# EAGLE design node (EAGLE 9.6.2)

## Sheet 1 of 5: MCU
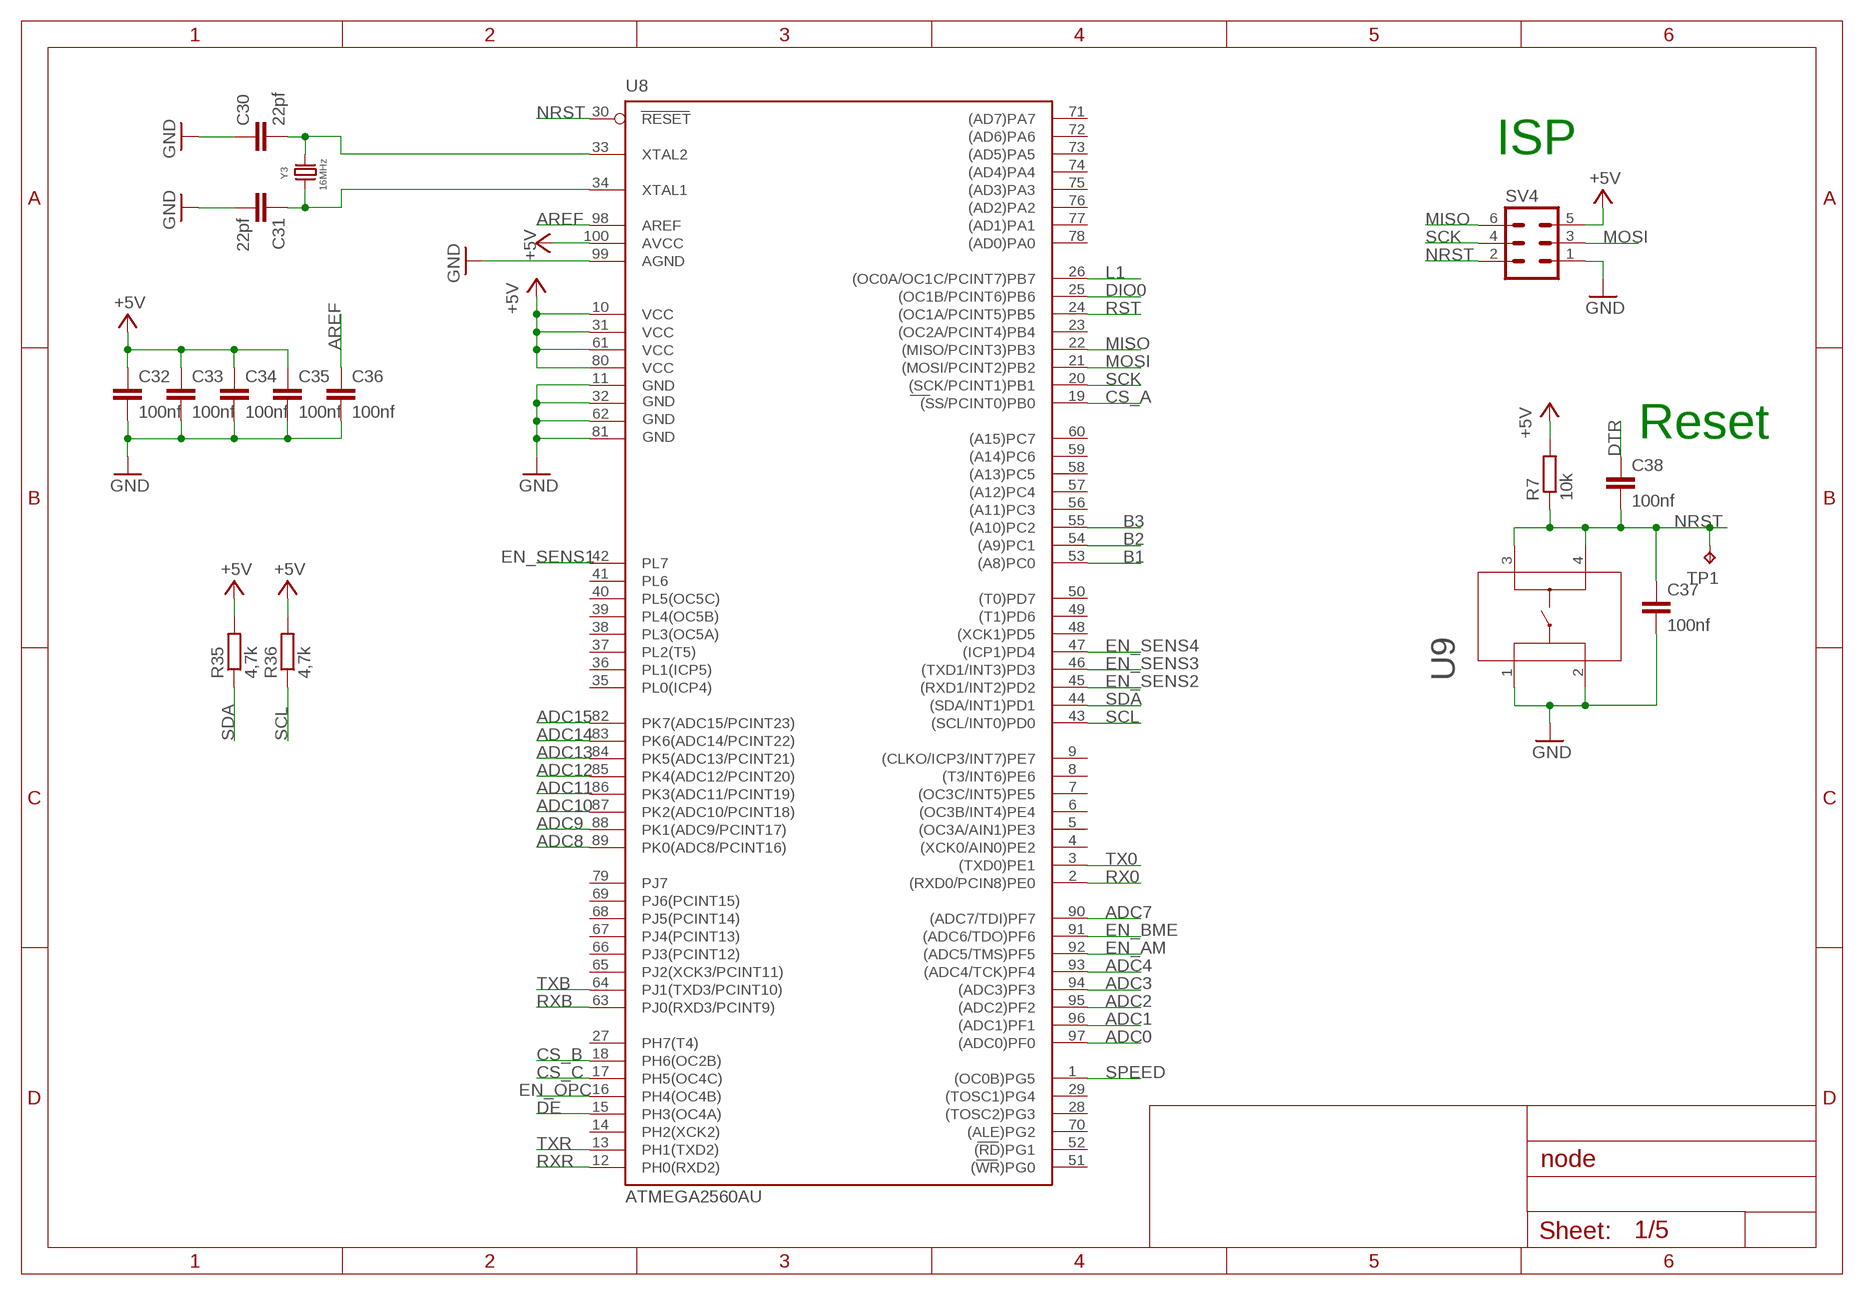
[diagram p0: schematic, sheet 1]

### Parts
C30  22pf  C-EUC0603  [C0603]
C31  22pf  C-EUC0603  [C0603]
C32  100nf  C-EUC0805  [C0805]
C33  100nf  C-EUC0805  [C0805]
C34  100nf  C-EUC0805  [C0805]
C35  100nf  C-EUC0805  [C0805]
C36  100nf  C-EUC0805  [C0805]
C37  100nf  C-EUC0805  [C0805]
C38  100nf  C-EUC0805  [C0805]
R7  10k  R-EU_R0805  [R0805]
R35  4,7k  R-EU_R0603  [R0603]
R36  4,7k  R-EU_R0603  [R0603]
SV4  MA03-2  [MA03-2]
TP1  TPTP13R  [TP13R]
U8  ATMEGA2560AU  [TQFP100]
U9  1-1825910-0  [SWITCH_1-1825910-0]
Y3  16MHz  WE-XTAL_HC49/4H_830003240B  [WE-XTAL_HC49/4H]

### Nets
+5V: C32.1 C33.1 C34.1 C35.1 R7.2 R35.2 R36.2 SV4.5 U8.10(VCC) U8.31(VCC1) U8.61(VCC2) U8.80(VCC3) U8.100(AVCC) ; also sheet 2,3,4,5
ADC0: U8.97((ADC0)PF0)
ADC1: U8.96((ADC1)PF1) ; also sheet 5
ADC2: U8.95((ADC2)PF2) ; also sheet 5
ADC3: U8.94((ADC3)PF3) ; also sheet 5
ADC4: U8.93((ADC4/TCK)PF4) ; also sheet 5
ADC7: U8.90((ADC7/TDI)PF7) ; also sheet 3
ADC8: U8.89(PK0(ADC8/PCINT16))
ADC9: U8.88(PK1(ADC9/PCINT17))
ADC10: U8.87(PK2(ADC10/PCINT18))
ADC11: U8.86(PK3(ADC11/PCINT19))
ADC12: U8.85(PK4(ADC12/PCINT20))
ADC13: U8.84(PK5(ADC13/PCINT21))
ADC14: U8.83(PK6(ADC14/PCINT22))
ADC15: U8.82(PK7(ADC15/PCINT23))
AREF: C36.1 U8.98(AREF)
B1: U8.53((A8)PC0) ; also sheet 5
B2: U8.54((A9)PC1) ; also sheet 5
B3: U8.55((A10)PC2)
CS_A: U8.19((SS/PCINT0)PB0) ; also sheet 2
CS_B: U8.18(PH6(OC2B)) ; also sheet 3
CS_C: U8.17(PH5(OC4C)) ; also sheet 3
DE: U8.15(PH3(OC4A)) ; also sheet 2
DIO0: U8.25((OC1B/PCINT6)PB6) ; also sheet 2
DTR: C38.1 ; also sheet 2
EN_AM: U8.92((ADC5/TMS)PF5) ; also sheet 3
EN_BME: U8.91((ADC6/TDO)PF6) ; also sheet 3
EN_OPC: U8.16(PH4(OC4B)) ; also sheet 3
EN_SENS1: U8.42(PL7) ; also sheet 3
EN_SENS2: U8.45((RXD1/INT2)PD2) ; also sheet 3
EN_SENS3: U8.46((TXD1/INT3)PD3) ; also sheet 3
EN_SENS4: U8.47((ICP1)PD4) ; also sheet 3
GND: C30.1 C31.2 C32.2 C33.2 C34.2 C35.2 C36.2 C37.2 SV4.1 U8.11(GND) U8.32(GND1) U8.62(GND2) U8.81(GND3) U8.99(AGND) U9.1 U9.2 ; also sheet 2,3,4,5
L1: U8.26((OC0A/OC1C/PCINT7)PB7) ; also sheet 2
MISO: SV4.6 U8.22((MISO/PCINT3)PB3) ; also sheet 2,3
MOSI: SV4.3 U8.21((MOSI/PCINT2)PB2) ; also sheet 2,3
N$23: C30.2 U8.33(XTAL2) Y3.2
N$27: C31.1 U8.34(XTAL1) Y3.1
NRST: C37.1 C38.2 R7.1 SV4.2 TP1.TP U8.30(RESET) U9.3 U9.4
RST: U8.24((OC1A/PCINT5)PB5) ; also sheet 2
RX0: U8.2((RXD0/PCIN8)PE0) ; also sheet 2
RXB: U8.63(PJ0(RXD3/PCINT9)) ; also sheet 2
RXR: U8.12(PH0(RXD2)) ; also sheet 2
SCK: SV4.4 U8.20((SCK/PCINT1)PB1) ; also sheet 2,3
SCL: R36.1 U8.43((SCL/INT0)PD0) ; also sheet 2,3,4,5
SDA: R35.1 U8.44((SDA/INT1)PD1) ; also sheet 2,3,4,5
SPEED: U8.1((OC0B)PG5) ; also sheet 3
TX0: U8.3((TXD0)PE1) ; also sheet 2
TXB: U8.64(PJ1(TXD3/PCINT10)) ; also sheet 2
TXR: U8.13(PH1(TXD2)) ; also sheet 2
Unconnected: U8.4((XCK0/AIN0)PE2) U8.5((OC3A/AIN1)PE3) U8.6((OC3B/INT4)PE4) U8.7((OC3C/INT5)PE5) U8.8((T3/INT6)PE6) U8.9((CLKO/ICP3/INT7)PE7) U8.14(PH2(XCK2)) U8.23((OC2A/PCINT4)PB4) U8.27(PH7(T4)) U8.28((TOSC2)PG3) U8.29((TOSC1)PG4) U8.35(PL0(ICP4)) U8.36(PL1(ICP5)) U8.37(PL2(T5)) U8.38(PL3(OC5A)) U8.39(PL4(OC5B)) U8.40(PL5(OC5C)) U8.41(PL6) U8.48((XCK1)PD5) U8.49((T1)PD6) U8.50((T0)PD7) U8.51((WR)PG0) U8.52((RD)PG1) U8.56((A11)PC3) U8.57((A12)PC4) U8.58((A13)PC5) U8.59((A14)PC6) U8.60((A15)PC7) U8.65(PJ2(XCK3/PCINT11)) U8.66(PJ3(PCINT12)) U8.67(PJ4(PCINT13)) U8.68(PJ5(PCINT14)) U8.69(PJ6(PCINT15)) U8.70((ALE)PG2) U8.71((AD7)PA7) U8.72((AD6)PA6) U8.73((AD5)PA5) U8.74((AD4)PA4) U8.75((AD3)PA3) U8.76((AD2)PA2) U8.77((AD1)PA1) U8.78((AD0)PA0) U8.79(PJ7)

### Notes on the sheet
- ISP
- Reset

## Sheet 2 of 5
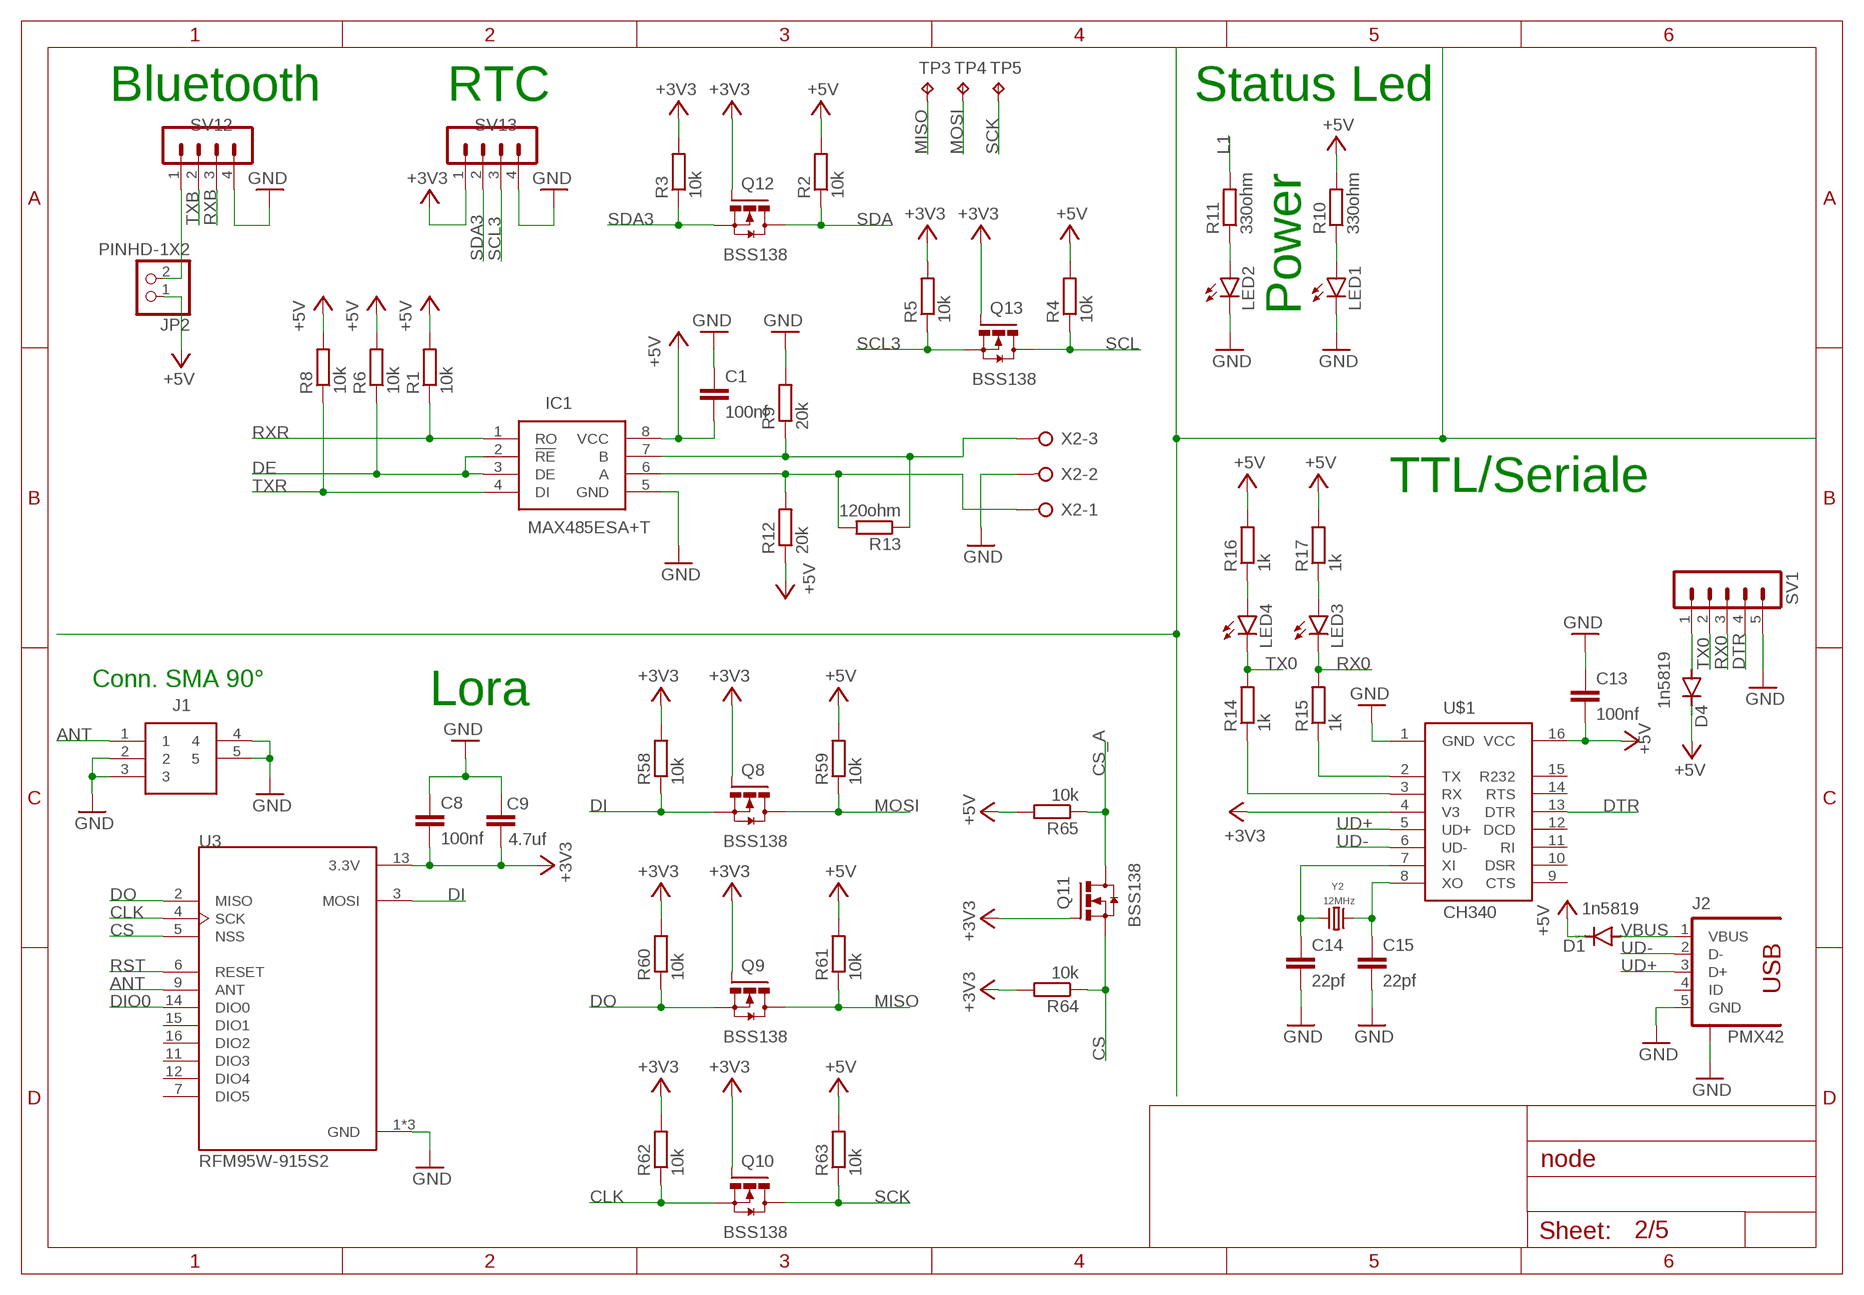
[diagram p1: schematic, sheet 2]

### Parts
C1  100nf  C-EUC0805  [C0805]
C8  100nf  C-EUC0805  [C0805]
C9  4.7uf  C-EUC1206K  [C1206K]
C13  100nf  C-EUC0805  [C0805]
C14  22pf  C-EUC0603  [C0603]
C15  22pf  C-EUC0603  [C0603]
D1  1n5819  DIODE-SOD123  [SOD123]
D4  1n5819  DIODE-SOD123  [SOD123]
IC1  MAX485ESA+T  [SOIC127P600X175-8N]
J1  5-1814400-1  [518144001]
J2  PMX42  PMX42_56579-0576  [PMX42_56579-0576]
JP2  PINHD-1X2  [1X02]
LED1  LEDSML0805  [SML0805]
LED2  LEDSML0805  [SML0805]
LED3  LEDSML0805  [SML0805]
LED4  LEDSML0805  [SML0805]
Q8  BSS138  [SOT23-3]
Q9  BSS138  [SOT23-3]
Q10  BSS138  [SOT23-3]
Q11  BSS138  [SOT23-3]
Q12  BSS138  [SOT23-3]
Q13  BSS138  [SOT23-3]
R1  10k  R-EU_R0805  [R0805]
R2  10k  R-EU_R0805  [R0805]
R3  10k  R-EU_R0805  [R0805]
R4  10k  R-EU_R0805  [R0805]
R5  10k  R-EU_R0805  [R0805]
R6  10k  R-EU_R0805  [R0805]
R8  10k  R-EU_R0805  [R0805]
R9  20k  R-EU_R0805  [R0805]
R10  330ohm  R-EU_R0805  [R0805]
R11  330ohm  R-EU_R0805  [R0805]
R12  20k  R-EU_R0805  [R0805]
R13  120ohm  R-EU_R0805  [R0805]
R14  1k  R-EU_R0805  [R0805]
R15  1k  R-EU_R0805  [R0805]
R16  1k  R-EU_R0805  [R0805]
R17  1k  R-EU_R0805  [R0805]
R58  10k  R-EU_R0805  [R0805]
R59  10k  R-EU_R0805  [R0805]
R60  10k  R-EU_R0805  [R0805]
R61  10k  R-EU_R0805  [R0805]
R62  10k  R-EU_R0805  [R0805]
R63  10k  R-EU_R0805  [R0805]
R64  10k  R-EU_R0805  [R0805]
R65  10k  R-EU_R0805  [R0805]
SV1  MA05-1  [MA05-1]
SV12  MA04-1  [MA04-1]
SV13  MA04-1  [MA04-1]
TP3  TPTP13R  [TP13R]
TP4  TPTP13R  [TP13R]
TP5  TPTP13R  [TP13R]
U3  RFM95W-915S2  [XCVR_RFM95W-915S2]
U$1  CH340  [SOIC16]
X2  W237-3E  [W237-3E]
Y2  12MHz  WE-XTAL_HC49/4H_830003063B  [WE-XTAL_HC49/4H]

### Nets
+3V3: C8.2 C9.1 Q8.1(G) Q9.1(G) Q10.1(G) Q11.1(G) Q12.1(G) Q13.1(G) R3.2 R5.2 R58.2 R60.2 R62.2 R64.2 SV13.1 U3.13(3.3V) U$1.4(V3) ; also sheet 4
+5V: C1.2 C13.2 D1.C D4.C IC1.8(VCC) JP2.1 R1.2 R2.2 R4.2 R6.2 R8.2 R10.2 R12.1 R16.2 R17.2 R59.2 R61.2 R63.2 R65.2 U$1.16(VCC) ; also sheet 1,3,4,5
ANT: J1.1 U3.9(ANT)
CLK: Q10.2(S) R62.1 U3.4(SCK)
CS: Q11.2(S) R64.1 U3.5(NSS)
CS_A: Q11.3(D) R65.1 ; also sheet 1
DE: IC1.2(!RE) IC1.3(DE) R6.1 ; also sheet 1
DI: Q8.2(S) R58.1 U3.3(MOSI)
DIO0: U3.14(DIO0) ; also sheet 1
DO: Q9.2(S) R60.1 U3.2(MISO)
DTR: SV1.4 U$1.13(DTR) ; also sheet 1
GND: C1.1 C8.1 C9.2 C13.1 C14.2 C15.2 IC1.5(GND) J1.2 J1.3 J1.4 J1.5 J2.5(GND) J2.S1(S) J2.S2(S) J2.S3(S) J2.S4(S) LED1.C LED2.C R9.2 SV1.5 SV12.4 SV13.4 U3.1(GND) U3.8(GND) U3.10(GND) U$1.1(GND) X2.2 ; also sheet 1,3,4,5
L1: R11.2 ; also sheet 1
MISO: Q9.3(D) R61.1 TP3.TP ; also sheet 1,3
MOSI: Q8.3(D) R59.1 TP4.TP ; also sheet 1,3
N$1: JP2.2 SV12.1
N$10: LED1.A R10.1
N$11: LED2.A R11.1
N$13: R15.1 U$1.2(TX)
N$14: R14.1 U$1.3(RX)
N$15: C15.1 U$1.8(XO) Y2.1
N$16: C14.1 U$1.7(XI) Y2.2
N$17: LED3.A R17.1
N$18: LED4.A R16.1
N$24: D4.A SV1.1
N$30: IC1.6(A) R12.2 R13.2 X2.1
N$31: IC1.7(B) R9.1 R13.1 X2.3
RST: U3.6(RESET) ; also sheet 1
RX0: LED3.C R15.2 SV1.3 ; also sheet 1
RXB: SV12.3 ; also sheet 1
RXR: IC1.1(RO) R1.1 ; also sheet 1
SCK: Q10.3(D) R63.1 TP5.TP ; also sheet 1,3
SCL: Q13.3(D) R4.1 ; also sheet 1,3,4,5
SCL3: Q13.2(S) R5.1 SV13.3
SDA: Q12.3(D) R2.1 ; also sheet 1,3,4,5
SDA3: Q12.2(S) R3.1 SV13.2
TX0: LED4.C R14.2 SV1.2 ; also sheet 1
TXB: SV12.2 ; also sheet 1
TXR: IC1.4(DI) R8.1 ; also sheet 1
UD+: J2.3(D+) U$1.5(UD+)
UD-: J2.2(D-) U$1.6(UD-)
VBUS: D1.A J2.1(VBUS)
Unconnected: J2.4(ID) U3.7(DIO5) U3.11(DIO3) U3.12(DIO4) U3.15(DIO1) U3.16(DIO2) U$1.9(CTS) U$1.10(DSR) U$1.11(RI) U$1.12(DCD) U$1.14(RTS) U$1.15(R232)

### Notes on the sheet
- Bluetooth | RTC | Status Led
- Power
- TTL/Seriale
- Conn. SMA 90°
- Lora

## Sheet 3 of 5
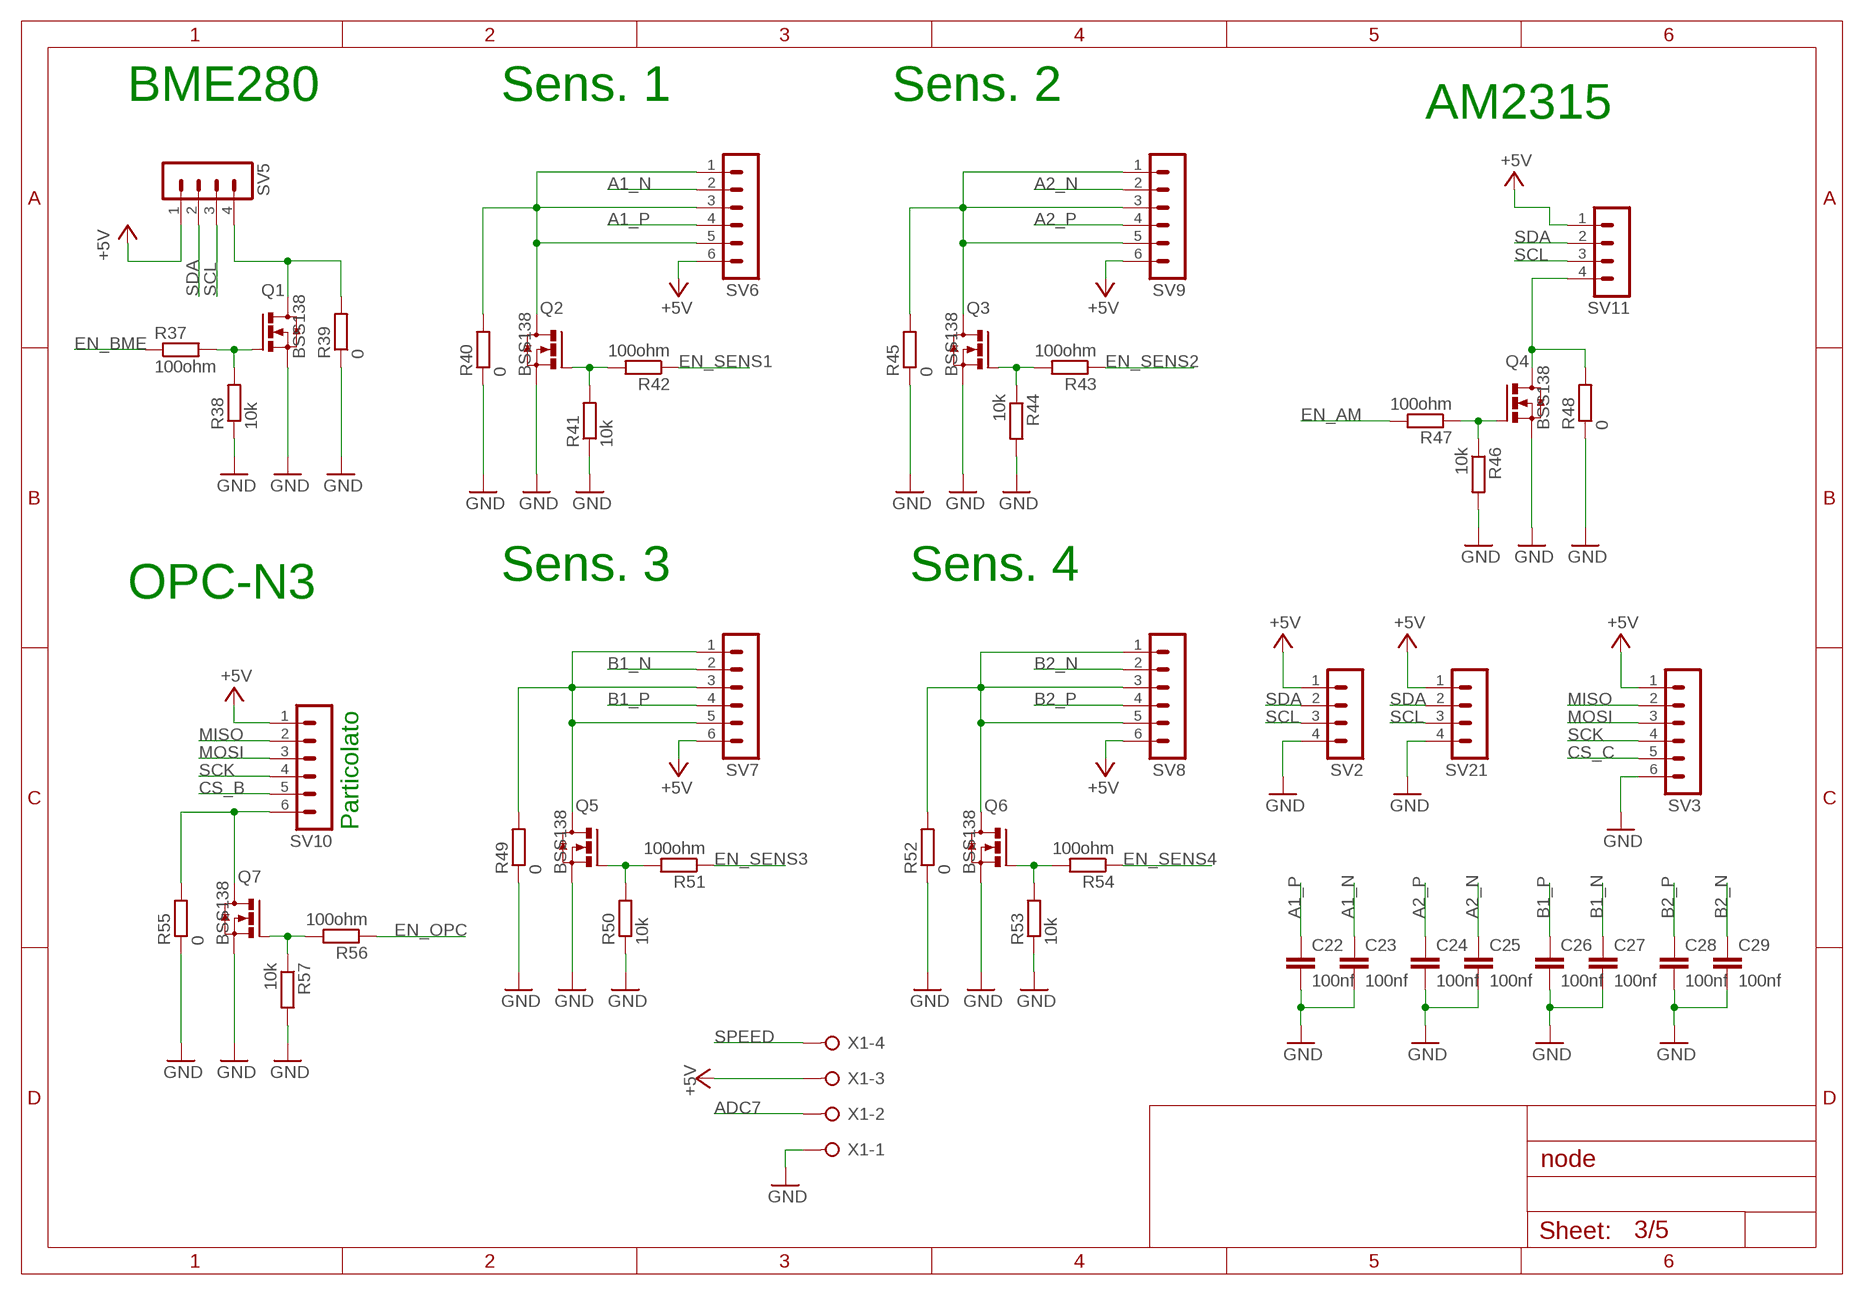
[diagram p2: schematic, sheet 3]

### Parts
C22  100nf  C-EUC0805  [C0805]
C23  100nf  C-EUC0805  [C0805]
C24  100nf  C-EUC0805  [C0805]
C25  100nf  C-EUC0805  [C0805]
C26  100nf  C-EUC0805  [C0805]
C27  100nf  C-EUC0805  [C0805]
C28  100nf  C-EUC0805  [C0805]
C29  100nf  C-EUC0805  [C0805]
Q1  BSS138  [SOT23-3]
Q2  BSS138  [SOT23-3]
Q3  BSS138  [SOT23-3]
Q4  BSS138  [SOT23-3]
Q5  BSS138  [SOT23-3]
Q6  BSS138  [SOT23-3]
Q7  BSS138  [SOT23-3]
R37  100ohm  R-EU_R0805W  [R0805W]
R38  10k  R-EU_R0805W  [R0805W]
R39  0  R-EU_R0603  [R0603]
R40  0  R-EU_R0603  [R0603]
R41  10k  R-EU_R0805W  [R0805W]
R42  100ohm  R-EU_R0805W  [R0805W]
R43  100ohm  R-EU_R0805W  [R0805W]
R44  10k  R-EU_R0805W  [R0805W]
R45  0  R-EU_R0603  [R0603]
R46  10k  R-EU_R0805W  [R0805W]
R47  100ohm  R-EU_R0805W  [R0805W]
R48  0  R-EU_R0603  [R0603]
R49  0  R-EU_R0603  [R0603]
R50  10k  R-EU_R0805W  [R0805W]
R51  100ohm  R-EU_R0805W  [R0805W]
R52  0  R-EU_R0603  [R0603]
R53  10k  R-EU_R0805W  [R0805W]
R54  100ohm  R-EU_R0805W  [R0805W]
R55  0  R-EU_R0603  [R0603]
R56  100ohm  R-EU_R0805W  [R0805W]
R57  10k  R-EU_R0805W  [R0805W]
SV2  MA04-1  [MA04-1]
SV3  MA06-1  [MA06-1]
SV5  MA04-1  [MA04-1]
SV6  MA06-1  [MA06-1]
SV7  MA06-1  [MA06-1]
SV8  MA06-1  [MA06-1]
SV9  MA06-1  [MA06-1]
SV10  MA06-1  [MA06-1]
SV11  MA04-1  [MA04-1]
SV21  MA04-1  [MA04-1]
X1  W237-04P  [W237-4P]

### Nets
+5V: SV2.1 SV3.1 SV5.1 SV6.6 SV7.6 SV8.6 SV9.6 SV10.1 SV11.1 SV21.1 X1.3 ; also sheet 1,2,4,5
A1_N [diff pair]: C23.1 SV6.2 ; also sheet 4
A1_P [diff pair]: C22.1 SV6.4 ; also sheet 4
A2_N [diff pair]: C25.1 SV9.2 ; also sheet 4
A2_P [diff pair]: C24.1 SV9.4 ; also sheet 4
ADC7: X1.2 ; also sheet 1
B1_N [diff pair]: C27.1 SV7.2 ; also sheet 4
B1_P [diff pair]: C26.1 SV7.4 ; also sheet 4
B2_N [diff pair]: C29.1 SV8.2 ; also sheet 4
B2_P [diff pair]: C28.1 SV8.4 ; also sheet 4
CS_B: SV10.5 ; also sheet 1
CS_C: SV3.5 ; also sheet 1
EN_AM: R47.2 ; also sheet 1
EN_BME: R37.1 ; also sheet 1
EN_OPC: R56.1 ; also sheet 1
EN_SENS1: R42.1 ; also sheet 1
EN_SENS2: R43.1 ; also sheet 1
EN_SENS3: R51.1 ; also sheet 1
EN_SENS4: R54.1 ; also sheet 1
GND: C22.2 C23.2 C24.2 C25.2 C26.2 C27.2 C28.2 C29.2 Q1.2(S) Q2.2(S) Q3.2(S) Q4.2(S) Q5.2(S) Q6.2(S) Q7.2(S) R38.1 R39.1 R40.1 R41.1 R44.2 R45.1 R46.2 R48.1 R49.1 R50.1 R52.1 R53.1 R55.1 R57.2 SV2.4 SV3.6 SV21.4 X1.1 ; also sheet 1,2,4,5
MISO: SV3.2 SV10.2 ; also sheet 1,2
MOSI: SV3.3 SV10.3 ; also sheet 1,2
N$2: Q1.3(D) R39.2 SV5.4
N$3: Q1.1(G) R37.2 R38.2
N$8: Q6.3(D) R52.2 SV8.1 SV8.3 SV8.5
N$9: Q2.3(D) R40.2 SV6.1 SV6.3 SV6.5
N$19: Q5.3(D) R49.2 SV7.1 SV7.3 SV7.5
N$20: Q2.1(G) R41.2 R42.2
N$28: Q4.3(D) R48.2 SV11.4
N$29: Q3.3(D) R45.2 SV9.1 SV9.3 SV9.5
N$32: Q3.1(G) R43.2 R44.1
N$33: Q4.1(G) R46.1 R47.1
N$34: Q6.1(G) R53.2 R54.2
N$35: Q5.1(G) R50.2 R51.2
N$36: Q7.3(D) R55.2 SV10.6
N$38: Q7.1(G) R56.2 R57.1
SCK: SV3.4 SV10.4 ; also sheet 1,2
SCL: SV2.3 SV5.3 SV11.3 SV21.3 ; also sheet 1,2,4,5
SDA: SV2.2 SV5.2 SV11.2 SV21.2 ; also sheet 1,2,4,5
SPEED: X1.4 ; also sheet 1

### Notes on the sheet
- BME280 | Sens. 1 | Sens. 2
- AM2315
- Sens. 3 | Sens. 4
- OPC-N3
- Particolato

## Sheet 4 of 5
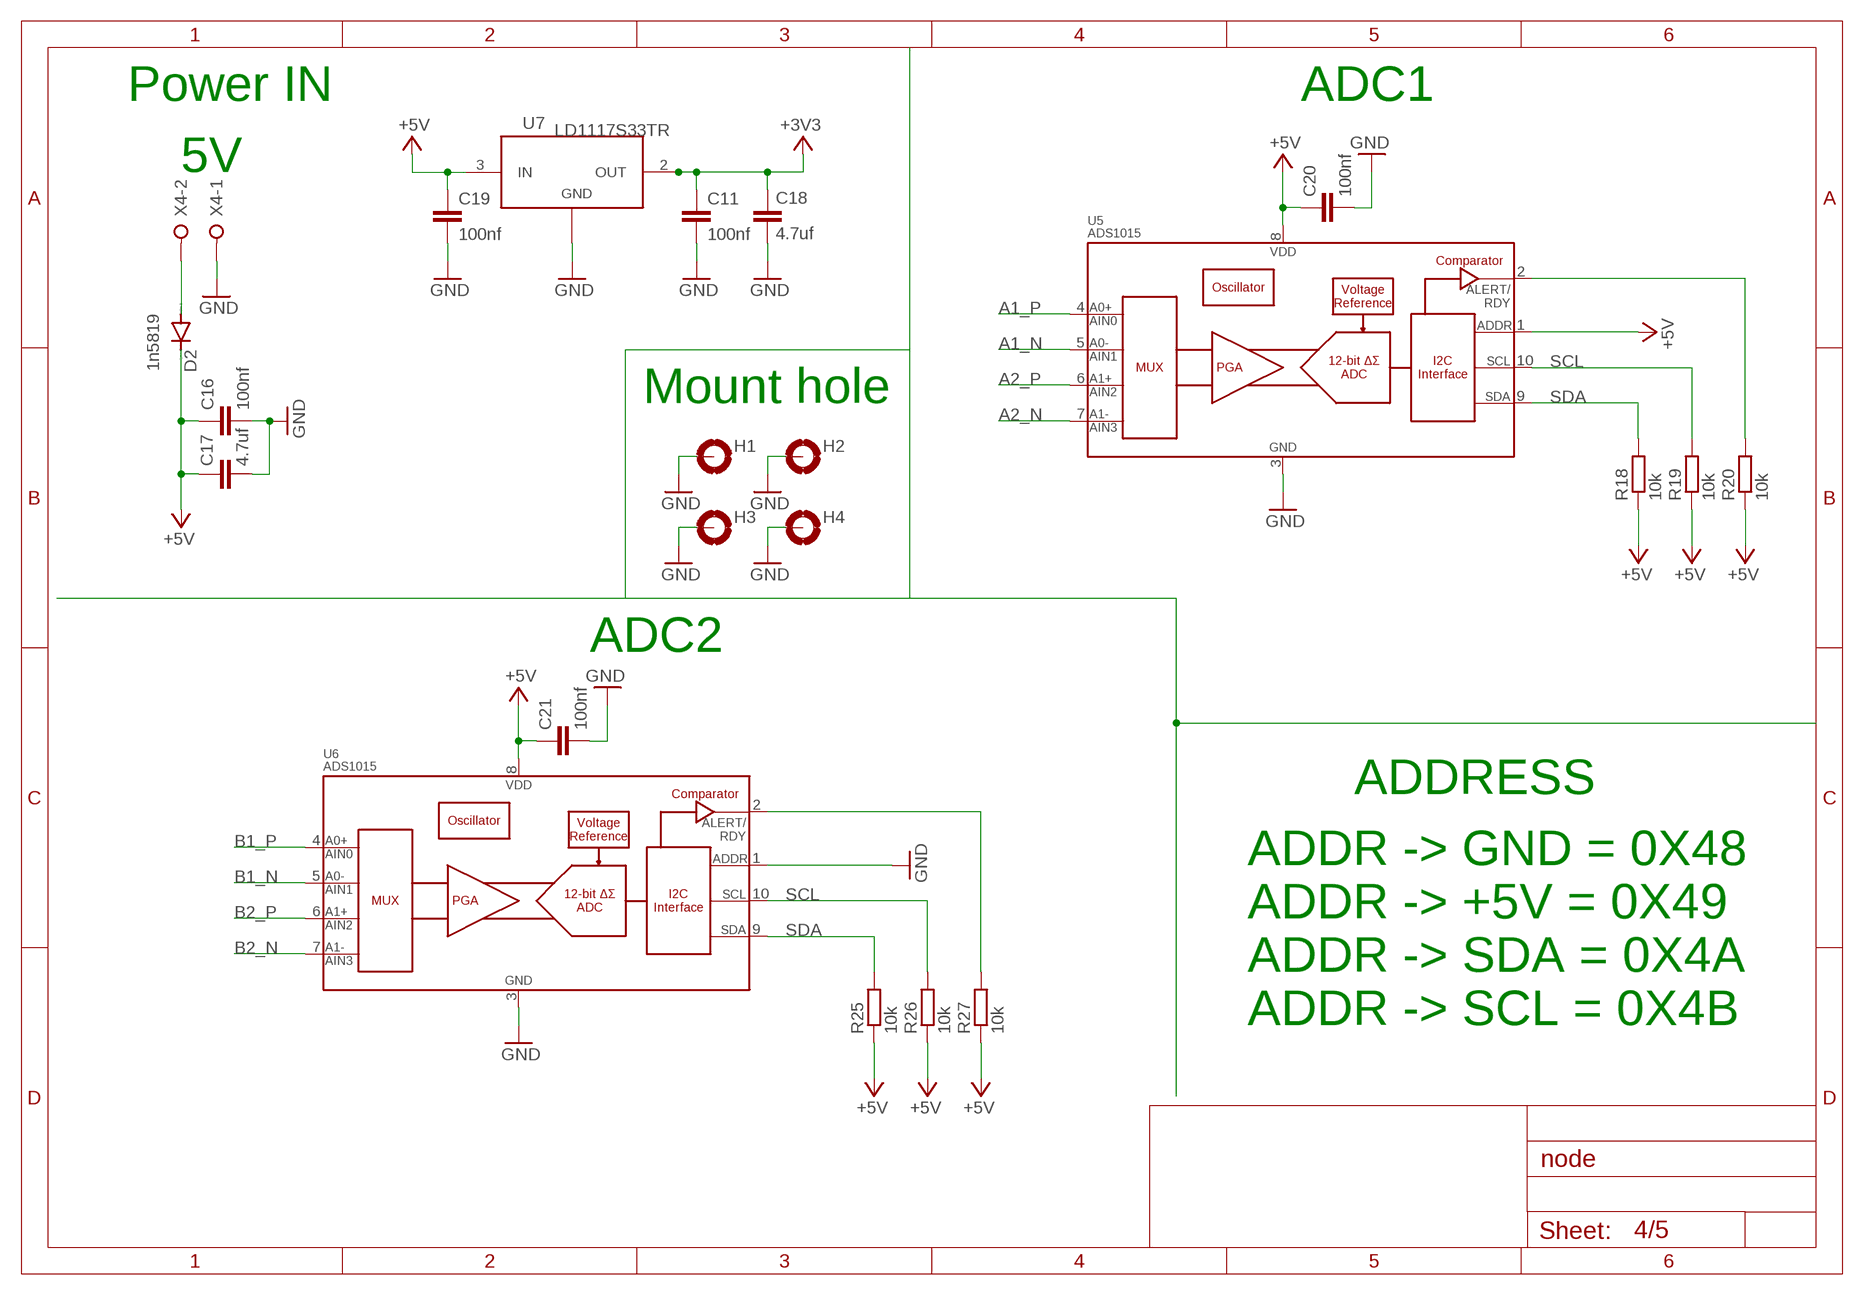
[diagram p3: schematic, sheet 4]

### Parts
C11  100nf  C-EUC0805  [C0805]
C16  100nf  C-EUC0805  [C0805]
C17  4.7uf  C-EUC1206K  [C1206K]
C18  4.7uf  C-EUC1206K  [C1206K]
C19  100nf  C-EUC0805  [C0805]
C20  100nf  C-EUC0805  [C0805]
C21  100nf  C-EUC0805  [C0805]
D2  1n5819  DIODE-SOD123  [SOD123]
H1  MOUNT-PAD-ROUND3.2  [3,2-PAD]
H2  MOUNT-PAD-ROUND3.2  [3,2-PAD]
H3  MOUNT-PAD-ROUND3.2  [3,2-PAD]
H4  MOUNT-PAD-ROUND3.2  [3,2-PAD]
R18  10k  R-EU_R0805  [R0805]
R19  10k  R-EU_R0805  [R0805]
R20  10k  R-EU_R0805  [R0805]
R25  10k  R-EU_R0805  [R0805]
R26  10k  R-EU_R0805  [R0805]
R27  10k  R-EU_R0805  [R0805]
U5  ADS1015  [MSOP10]
U6  ADS1015  [MSOP10]
U7  LD1117S33TR  [SOT-223]
X4  W237-02P  [W237-132]

### Nets
+3V3: C11.1 C18.1 U7.2(OUT) U7.4 ; also sheet 2
+5V: C16.1 C17.1 C19.1 C20.1 C21.1 D2.C R18.1 R19.1 R20.1 R25.1 R26.1 R27.1 U5.1(ADDR) U5.8(VDD) U6.8(VDD) U7.3(IN) ; also sheet 1,2,3,5
A1_N [diff pair]: U5.5(AIN1) ; also sheet 3
A1_P [diff pair]: U5.4(AIN0) ; also sheet 3
A2_N [diff pair]: U5.7(AIN3) ; also sheet 3
A2_P [diff pair]: U5.6(AIN2) ; also sheet 3
B1_N [diff pair]: U6.5(AIN1) ; also sheet 3
B1_P [diff pair]: U6.4(AIN0) ; also sheet 3
B2_N [diff pair]: U6.7(AIN3) ; also sheet 3
B2_P [diff pair]: U6.6(AIN2) ; also sheet 3
GND: C11.2 C16.2 C17.2 C18.2 C19.2 C20.2 C21.2 H1.B3,2(MOUNT) H2.B3,2(MOUNT) H3.B3,2(MOUNT) H4.B3,2(MOUNT) U5.3(VSS) U6.1(ADDR) U6.3(VSS) U7.1(ADJ/GND) X4.1 ; also sheet 1,2,3,5
N$21: D2.A X4.2
N$22: R20.2 U5.2(ALERT/RDY)
N$25: R27.2 U6.2(ALERT/RDY)
SCL: R19.2 R26.2 U5.10(SCL) U6.10(SCL) ; also sheet 1,2,3,5
SDA: R18.2 R25.2 U5.9(SDA) U6.9(SDA) ; also sheet 1,2,3,5

### Notes on the sheet
- Power IN | ADC1
- 5V
- Mount hole
- ADC2
- ADDRESS
- ADDR -> GND = 0X48
- ADDR -> +5V = 0X49
- ADDR -> SDA = 0X4A
- ADDR -> SCL = 0X4B

## Sheet 5 of 5
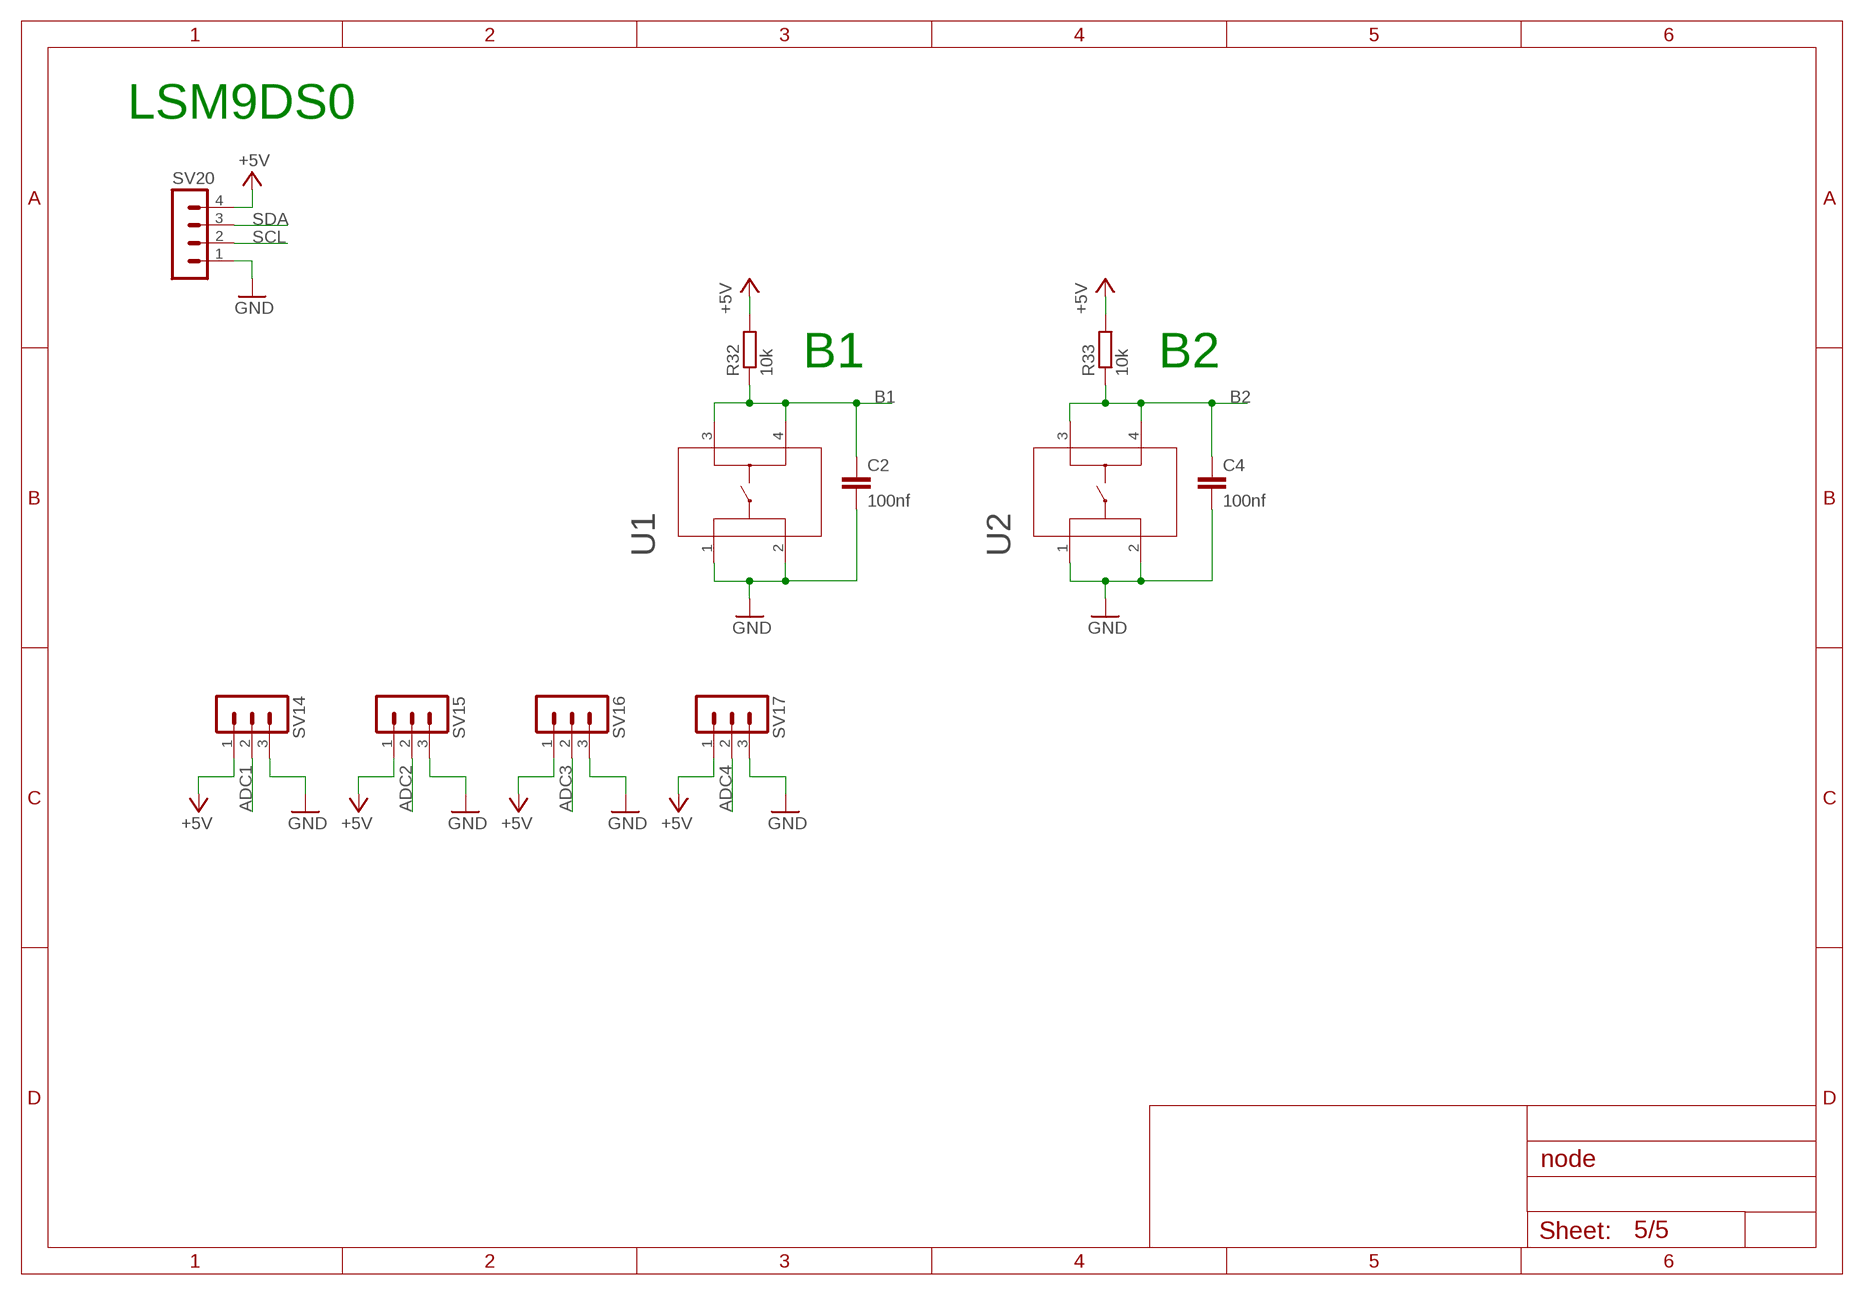
[diagram p4: schematic, sheet 5]

### Parts
C2  100nf  C-EUC0805  [C0805]
C4  100nf  C-EUC0805  [C0805]
R32  10k  R-EU_R0805  [R0805]
R33  10k  R-EU_R0805  [R0805]
SV14  MA03-1  [MA03-1]
SV15  MA03-1  [MA03-1]
SV16  MA03-1  [MA03-1]
SV17  MA03-1  [MA03-1]
SV20  MA04-1  [MA04-1]
U1  1-1825910-0  [SWITCH_1-1825910-0]
U2  1-1825910-0  [SWITCH_1-1825910-0]

### Nets
+5V: R32.2 R33.2 SV14.1 SV15.1 SV16.1 SV17.1 SV20.4 ; also sheet 1,2,3,4
ADC1: SV14.2 ; also sheet 1
ADC2: SV15.2 ; also sheet 1
ADC3: SV16.2 ; also sheet 1
ADC4: SV17.2 ; also sheet 1
B1: C2.1 R32.1 U1.3 U1.4 ; also sheet 1
B2: C4.1 R33.1 U2.3 U2.4 ; also sheet 1
GND: C2.2 C4.2 SV14.3 SV15.3 SV16.3 SV17.3 SV20.1 U1.1 U1.2 U2.1 U2.2 ; also sheet 1,2,3,4
SCL: SV20.2 ; also sheet 1,2,3,4
SDA: SV20.3 ; also sheet 1,2,3,4

### Notes on the sheet
- LSM9DS0
- B1 | B2

## Library data of the parts
C1 C2 C4 C8 C9 C11 C13-C38 = resistor:C-EU: CAPACITOR, European symbol
D1 D2 D4 = diode:DIODE-: DIODE
H1-H4 = holes:MOUNT-PAD-ROUND: MOUNTING PAD, round
IC1 = MAX485ESA+T:MAX485ESA+T: RS-422/RS-485 Interface IC Low-Power, Slew-Rate-Limited RS-485/RS-422 Transceivers Source: Datasheet <https://datasheets.maximintegrated.com/en/ds/MAX1487-MAX491.pdf>; DESCRIPTION: RS-422/RS-485 Interface IC Low-Power, Slew-Rate-Limited RS-485/RS-422 Transceivers; HEIGHT: 1.75mm; MANUFACTURER_NAME: Maxim Integrated; MANUFACTURER_PART_NUMBER: MAX485ESA+T; MOUSER_PART_NUMBER: 700-MAX485ESAT; MOUSER_PRICE-STOCK: https://www.mouser.co.uk/ProductDetail/Maxim-Integrated/MAX485ESA%2bT?qs=LHmEVA8xxfYXmvxEk%252BFtEg%3D%3D; RS_PART_NUMBER: 1900818P; RS_PRICE-STOCK: http://uk.rs-online.com/web/p/products/1900818P
J1 = 5-1814400-1:5-1814400-1: SMA Connector Jack, Female Socket 50 Ohm Through Hole, Right Angle Solder Source: Datasheet <https://www.te.com/commerce/DocumentDelivery/DDEController?Action=showdoc&DocId=Customer Drawing1814400DpdfEnglishENG_CD_1814400_D_baseFilename.pdf5-1814400-1>; ALLIED_NUMBER: 70084631; ALLIED_PRICE-STOCK: https://www.alliedelec.com/te-connectivity-5-1814400-1/70084631/; DESCRIPTION: SMA Connector Jack, Female Socket 50 Ohm Through Hole, Right Angle Solder; HEIGHT: 10.43mm; MANUFACTURER_NAME: TE Connectivity; MANUFACTURER_PART_NUMBER: 5-1814400-1; MOUSER_PART_NUMBER: 571-5-1814400-1; MOUSER_PRICE-STOCK: https://www.mouser.co.uk/ProductDetail/TE-Connectivity/5-1814400-1?qs=ZMVvPt2N%252B83mDSbcJPKgOA%3D%3D; RS_PART_NUMBER: 6163400; RS_PRICE-STOCK: http://uk.rs-online.com/web/p/products/6163400
J2 = 52101-101-REV-A:PMX42_56579-0576: USB - OTG, miniUSB Type AB, Molex
JP2 = Connector:PINHD-1X2: PIN HEADER; CATEGORY: CONNECTOR; SUB-CATEGORY: PIN-HEADER
LED1-LED4 = led:LED: LED OSRAM: - CHIPLED LG R971, LG N971, LY N971, LG Q971, LY Q971, LO R971, LY R971 LH N974, LH R974 LS Q976, LO Q976, LY Q976 LO Q996 - Hyper CHIPLED LW Q18S LB Q993, LB Q99A, LB R99A - SideLED LS A670, LO A670, LY A670, LG A670, LP A670 LB A673, LV A673, LT A673, LW A673 LH A674 LY A675 LS A676, LA A676, LO A676, LY A676, LW A676 LS A679, LY A679, LG A679 - Hyper Micro SIDELED® LS Y876, LA Y876, LO Y876, LY Y876 LT Y87S - SmartLED LW L88C, LW L88S LB L89C, LB L89S, LG L890 LS L89K, LO L89K, LY L89K LS L896, LA L896, LO L896, LY L896 - TOPLED LS T670, LO T670, LY T670, LG T670, LP T670 LSG T670, LSP T670, LSY T670, LOP T670, LYG T670 LG T671, LOG T671, LSG T671 LB T673, LV T673, LT T673, LW T673 LH T674 LS T676, LA T676, LO T676, LY T676, LB T676, LH T676, LSB T676, LW T676 LB T67C, LV T67C, LT T67C, LS T67K, LO T67K, LY T67K, LW E67C LS E67B, LA E67B, LO E67B, LY E67B, LB E67C, LV E67C, LT E67C LW T67C LS T679, LY T679, LG T679 LS T770, LO T770, LY T770, LG T770, LP T770 LB T773, LV T773, LT T773, LW T773 LH T774 LS E675, LA E675, LY E675, LS T675 LS T776, LA T776, LO T776, LY T776, LB T776 LHGB T686 LT T68C, LB T68C - Hyper Mini TOPLED® LB M676 - Mini TOPLED Santana® LG M470 LS M47K, LO M47K, LY M47K Source: http://www.osram.convergy.de LUXEON: - LUMILED® LXK2-PW12-R00, LXK2-PW12-S00, LXK2-PW14-U00, LXK2-PW14-V00 LXK2-PM12-R00, LXK2-PM12-S00, LXK2-PM14-U00 LXK2-PE12-Q00, LXK2-PE12-R00, LXK2-PE12-S00, LXK2-PE14-T00, LXK2-PE14-U00 LXK2-PB12-K00, LXK2-PB12-L00, LXK2-PB12-M00, LXK2-PB14-N00, LXK2-PB14-P00, LXK2-PB14-Q00 LXK2-PR12-L00, LXK2-PR12-M00, LXK2-PR14-Q00, LXK2-PR14-R00 LXK2-PD12-Q00, LXK2-PD12-R00, LXK2-PD12-S00 LXK2-PH12-R00, LXK2-PH12-S00 LXK2-PL12-P00, LXK2-PL12-Q00, LXK2-PL12-R00 Source: www.luxeon.com KINGBRIGHT: KA-3528ASYC Source: www.kingbright.com
Q1-Q13 = Transistor:BSS138: MOSFET N-CH 50V 220MA SOT-23 Manufacturer's datasheet <https://www.onsemi.com/pub/Collateral/BSS138-D.PDF>; CREATED_BY: PCBLayout.com; DIGIKEY_PART_NUMBER: BSS138CT-ND; MANUFACTURER: ON Semiconductor; MPN: BSS138; PACKAGE: SOT-23
R1-R20 R25-R27 R32 R33 R35-R65 = resistor:R-EU_: RESISTOR, European symbol
SV1 = con-lstb:MA05-1: PIN HEADER; OC_FARNELL: unknown; OC_NEWARK: unknown
SV2 SV5 SV11-SV13 SV20 SV21 = con-lstb:MA04-1: PIN HEADER; OC_FARNELL: unknown; OC_NEWARK: unknown
SV3 SV6-SV10 = con-lstb:MA06-1: PIN HEADER; OC_FARNELL: unknown; OC_NEWARK: unknown
SV4 = con-lstb:MA03-2: PIN HEADER; OC_FARNELL: unknown; OC_NEWARK: unknown
SV14-SV17 = con-lstb:MA03-1: PIN HEADER; OC_FARNELL: unknown; OC_NEWARK: unknown
TP1 TP3-TP5 = testpad:TP: Test pad
U1 U2 U9 = Switches:1-1825910-0; BUILT_BY: EMA_UL_Team; CATEGORY: Tactile Switches; COPYRIGHT: Copyright (C) 2016 Accelerated Designs. All rights reserved; DESCRIPTION: FSM6JH=6MM TACT SWITCH, HIGH TEMP; MANUFACTURER_PART_NUMBER: 1-1825910-0; PART_STATUS: active; SERIES: Unknown; VENDOR: TE Connectivity
U3 = RFM95W-915S2:RFM95W-915S2: RFM95(W) - Low Power Long Range Transceiver Module V1.0; AVAILABILITY: Unavailable; DESCRIPTION: General ISM < 1GHz LoRa™ Transceiver Module 915MHz Surface Mount; MF: RF Solutions; MP: RFM95W-915S2; PACKAGE: SMD-16 RF Solutions; PRICE: None
U5 U6 = SparkFun-IC-Conversion:ADS1015: ADS1015 12-BIT ADC 12-Bit Del-Sig ADC Four single-ended inputs or two differential inputs Internal PGA I2C interface 2.0-5.5V SparkFun Products SparkFun Block for Intel Edison - ADC <https://www.sparkfun.com/products/13770> (DEV-13770); PROD_ID: IC-12270
U7 = IC:LD1117S33TR: IC REG LINEAR 3.3V 800MA SOT223 Manufacturer's datasheet <http://www.st.com/content/ccc/resource/technical/document/datasheet/99/3b/7d/91/91/51/4b/be/CD00000544.pdf/files/CD00000544.pdf/jcr:content/translations/en.CD00000544.pdf>; CREATED_BY: PCBLayout.com; DIGIKEY_PART_NUMBER: 497-1242-2-ND; MANUFACTURER: STMicroelectronics; MPN: LD1117S33TR; PACKAGE: SOT-223
U8 = SparkFun-IC-Microcontroller:ATMEGA2560: Atmel 100-pin 8-bit uC 64/128/256 Kbytes FLASH 4 Kbytes EEPROM 8 Kbytes SRAM 86 General Purpose I/O pins 12-channels16-bit PWM 4 x Serial USARTs 16-channels 10-bit A/D SparkFun Products None.; PROD_ID: IC-10040
U$1 = CH340:CH340; AVAILABILITY: Unavailable; DESCRIPTION: Circuit Breaker Magnetic 3Pole 40A 240VAC; MF: Eaton; MP: CH340; PACKAGE: None; PRICE: None
X1 = con-wago-508:W237-04P: WAGO SREW CLAMP; OC_FARNELL: unknown; OC_NEWARK: unknown
X2 = con-wago-508:W237-3E: WAGO SREW CLAMP; OC_FARNELL: unknown; OC_NEWARK: unknown
X4 = con-wago-508:W237-02P: WAGO SREW CLAMP; OC_FARNELL: unknown; OC_NEWARK: unknown
Y2 = Wurth_Quartz Crystals & Oscillators_WE-XTAL:WE-XTAL_HC49/4H: WE-XTAL Quartz Crystal Characteristics Industry standard packages <https://katalog.we-online.com/media/images/v2/o135919v209%20Family_WE-XTAL_IQXC-42.jpg> Details see: https://katalog.we-online.com/en/pbs/WE-XTAL Updated by Ella Wu , 2019-09-03 2019 (C) Wurth Elektronik; C-LOAD: 20pF; DATASHEET-URL: https://www.we-online.com/catalog/datasheet/830003063B.pdf; MOUNT: THT; PART-NUMBER: 830003063B; STABILITY: 50ppm; TOLERANCE: ±30ppm; VALUE: 3.579545MHz
Y3 = Wurth_Quartz Crystals & Oscillators_WE-XTAL:WE-XTAL_HC49/4H: WE-XTAL Quartz Crystal Characteristics Industry standard packages <https://katalog.we-online.com/media/images/v2/o135919v209%20Family_WE-XTAL_IQXC-42.jpg> Details see: https://katalog.we-online.com/en/pbs/WE-XTAL Updated by Ella Wu , 2019-09-03 2019 (C) Wurth Elektronik; C-LOAD: 30pF; DATASHEET-URL: https://www.we-online.com/catalog/datasheet/830003240B.pdf; MOUNT: THT; PART-NUMBER: 830003240B; STABILITY: 50ppm; TOLERANCE: ±30ppm

## Net classes
1 diff pair: width 0.305 mm, clearance 0.127 mm

## Board
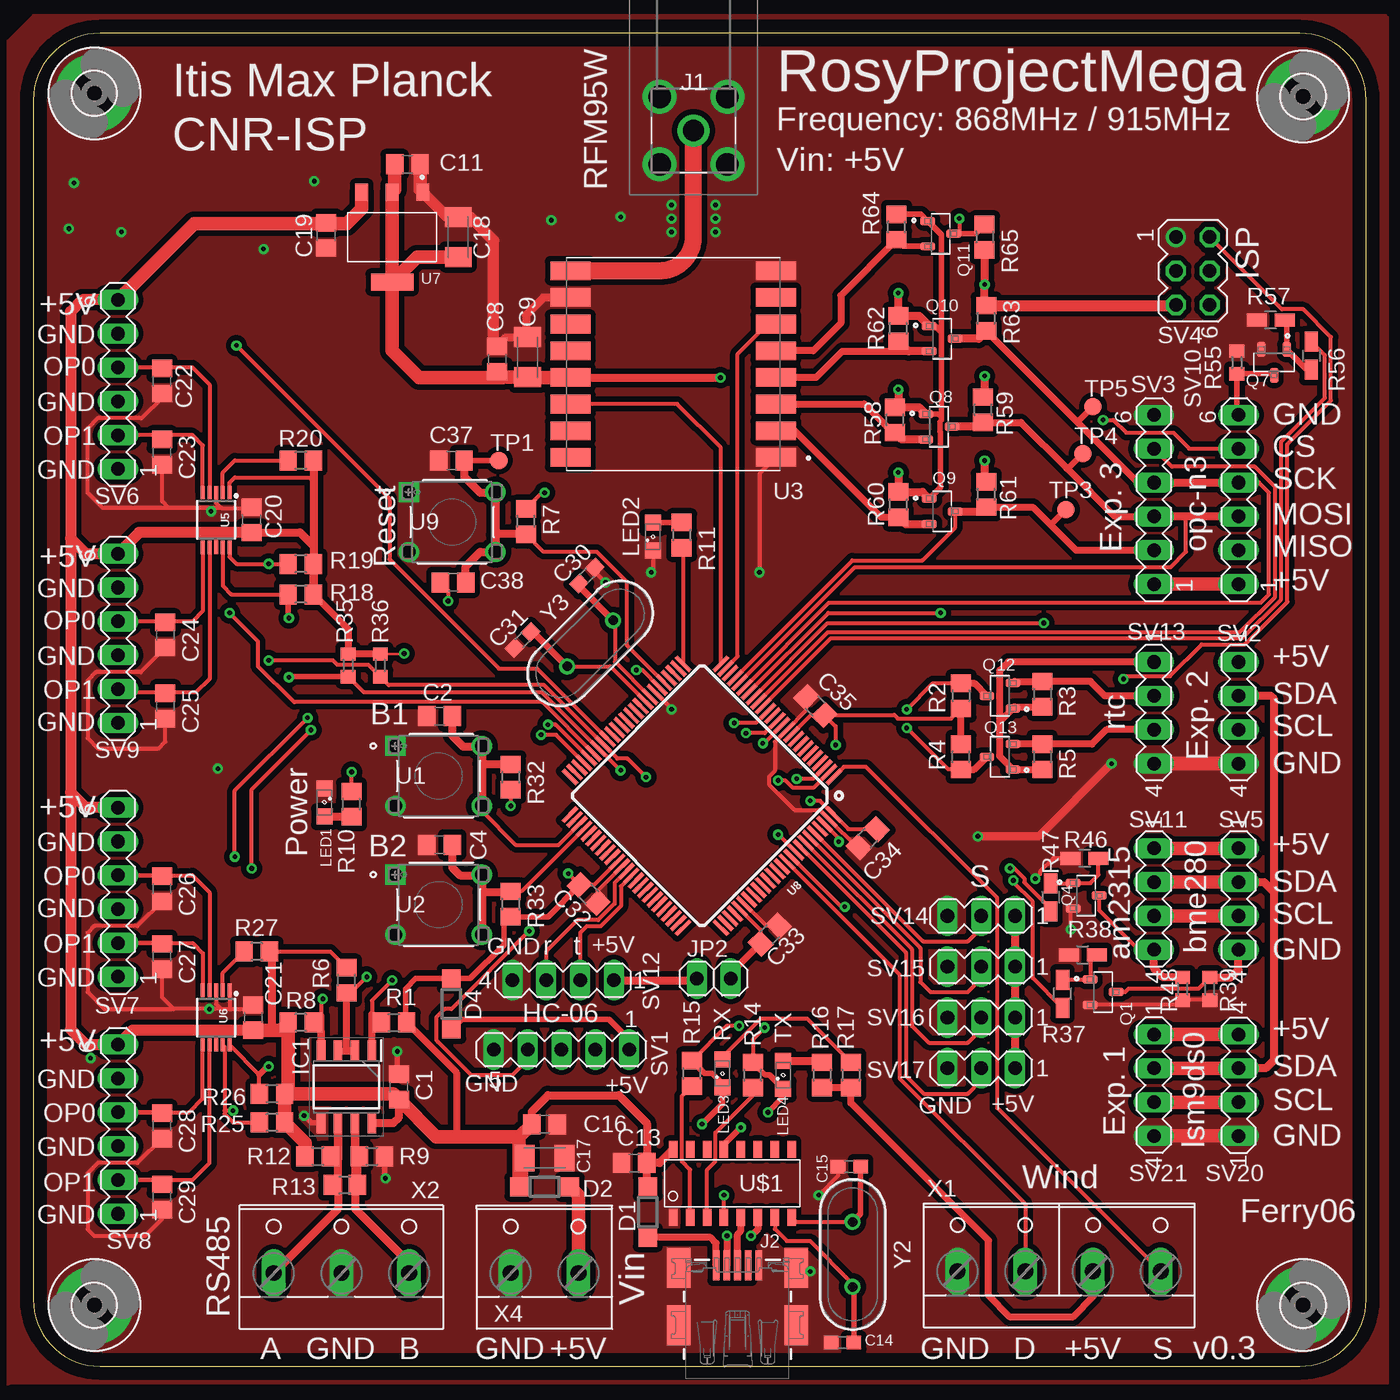
[diagram p5: board, top side]
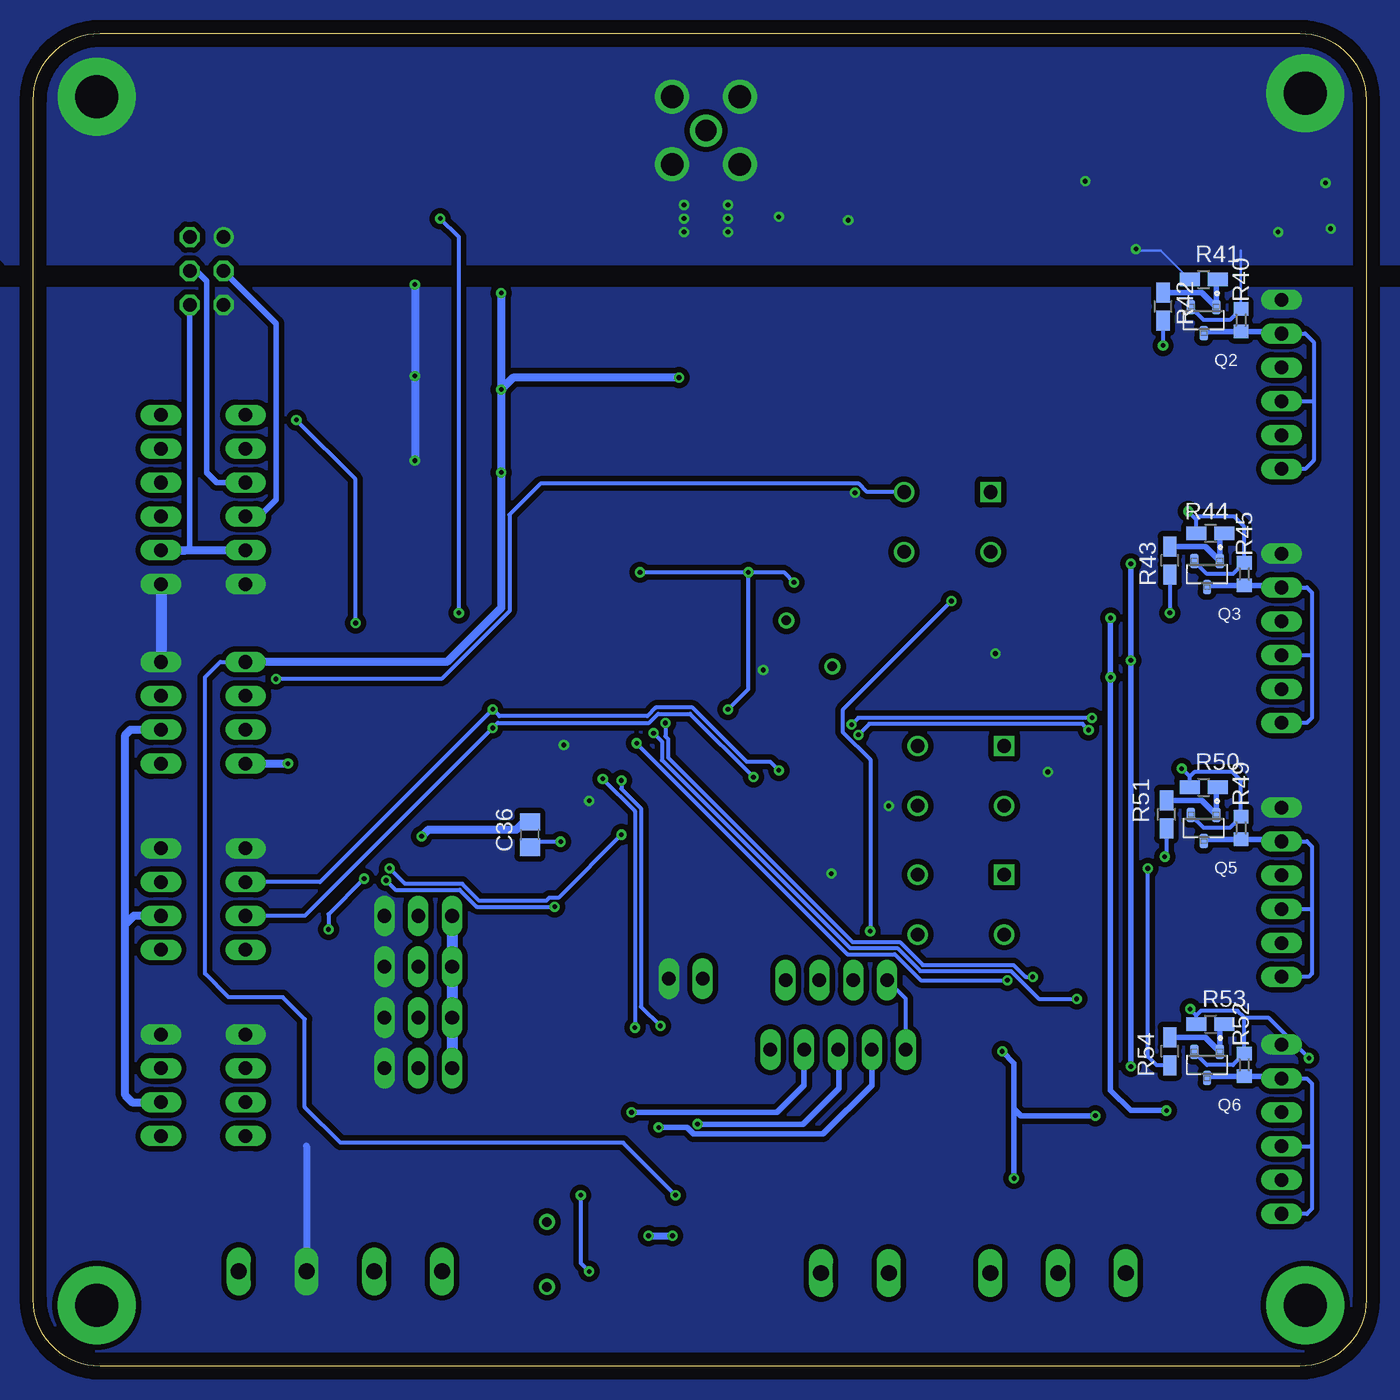
[diagram p6: board, bottom side, seen from below]

Size 100 x 100 mm. Coordinates in mm from the lower left corner, seen from the top.
Outline: 95,100 5,100 arc90 0,95 0,5 arc90 5,0 95,0 arc90 100,5 100,95 arc90 95,100
Copper layers (1*16): Top 0.035mm / dielectric 1.5mm / Bottom 0.035mm
Design rules "default": minimum track width 6mil, minimum drill 0.35mm, track to track 6mil, track to pad 6mil, pad to pad 6mil, via to via 6mil, smd to smd 6mil, copper to edge 40mil, drill to drill 6mil, minimum pad ring 10mil, minimum via ring 8mil, stop-mask expansion 4mil, vias tented up to drill 0mil, thermal gap 10mil

### Footprints (pad centres in the part's own frame; a part is rotated, then mirrored left to right if it is on the bottom)
C0805 = smd 1.3 x 1.5: 1 -0.95,0; 2 0.95,0
C1206K = smd 1.5 x 2: 1 -1.5,0; 2 1.5,0
C0603 = smd 1.1 x 1: 1 -0.85,0; 2 0.85,0
SOD123 = smd 1.4 x 1.4: A 1.9,0; C -1.9,0
3,2-PAD = drill 3.2 pad 5.842: B3,2 0,0
SOIC127P600X175-8N = smd 1.525 x 0.65: 1 -2.712,1.905; 2 -2.712,0.635; 3 -2.712,-0.635; 4 -2.712,-1.905; 5 2.712,-1.905; 6 2.712,-0.635; 7 2.712,0.635; 8 2.712,1.905
518144001 = drill 1.6 pad 2.4: 1 0,0 | drill 1.7 pad 2.55: 2 -2.54,2.54; 3 -2.54,-2.54; 4 2.54,-2.54; 5 2.54,2.54
PMX42_56579-0576 = smd 0.5 x 2.25: 1 1.6,-0.2; 2 0.8,-0.2; 3 0,-0.2; 4 -0.8,-0.2; 5 -1.6,-0.2 | smd 1.75 x 3: S1 -4.4,0; S2 4.4,0; S3 -4.4,4.3; S4 4.4,4.3
1X02 = drill 1.016 long: 1 -1.27,0; 2 1.27,0
SML0805 = smd 1.2 x 1.2: A 1.05,0; C -1.05,0
SOT23-3 = smd 0.62 x 1.1: 1 -0.95,-0.975; 2 0.95,-0.975; 3 0,0.975
R0805 = smd 1.3 x 1.5: 1 -0.95,0; 2 0.95,0
R0603 = smd 1 x 1.1: 1 -0.85,0; 2 0.85,0
R0805W = smd 1.5 x 1: 1 -1.052,0; 2 1.052,0
MA05-1 = drill 1.016 long: 1 -5.08,0; 2 -2.54,0; 3 0,0; 4 2.54,0; 5 5.08,0
MA04-1 = drill 1.016 long: 1 -3.81,0; 2 -1.27,0; 3 1.27,0; 4 3.81,0
MA06-1 = drill 1.016 long: 1 -6.35,0; 2 -3.81,0; 3 -1.27,0; 4 1.27,0; 5 3.81,0; 6 6.35,0
MA03-2 = drill 1.016: 1 -2.54,-1.27 | drill 1.016 octagon: 2 -2.54,1.27; 3 0,-1.27; 4 0,1.27; 5 2.54,-1.27; 6 2.54,1.27
MA03-1 = drill 1.016 long: 1 -2.54,0; 2 0,0; 3 2.54,0
TP13R = smd 1.3 x 1.3: TP 0,0
SWITCH_1-1825910-0 = drill 1.016 pad 1.524 square: 1 -6.502,4.496 | drill 1.016 pad 1.524: 2 -6.502,0; 3 0,0; 4 0,4.496
XCVR_RFM95W-915S2 = smd 3 x 1.4: 1 -7.7,7; 2 -7.7,5; 3 -7.7,3; 4 -7.7,1; 5 -7.7,-1; 6 -7.7,-3; 7 -7.7,-5; 8 -7.7,-7; 9 7.7,-7; 10 7.7,-5; 11 7.7,-3; 12 7.7,-1; 13 7.7,1; 14 7.7,3; 15 7.7,5; 16 7.7,7
MSOP10 = smd 0.3 x 1: 1 -1,-2.05; 2 -0.5,-2.05; 3 0,-2.05; 4 0.5,-2.05; 5 1,-2.05; 6 1,2.05; 7 0.5,2.05; 8 0,2.05; 9 -0.5,2.05; 10 -1,2.05
SOT-223 = smd 0.96 x 1.26: 1 -2.3,-3.375; 2 0,-3.375; 3 2.3,-3.375 | smd 3.19 x 1.26: 4 0,3.375
TQFP100 = smd 1.5 x 0.3: 1 -8,6; 2 -8,5.5; 3 -8,5; 4 -8,4.5; 5 -8,4; 6 -8,3.5; 7 -8,3; 8 -8,2.5; 9 -8,2; 10 -8,1.5; 11 -8,1; 12 -8,0.5; 13 -8,0; 14 -8,-0.5; 15 -8,-1; 16 -8,-1.5; 17 -8,-2; 18 -8,-2.5; 19 -8,-3; 20 -8,-3.5; 21 -8,-4; 22 -8,-4.5; 23 -8,-5; 24 -8,-5.5; 25 -8,-6; 51 8,-6; 52 8,-5.5; 53 8,-5; 54 8,-4.5; 55 8,-4; 56 8,-3.5; 57 8,-3; 58 8,-2.5; 59 8,-2; 60 8,-1.5; 61 8,-1; 62 8,-0.5; 63 8,0; 64 8,0.5; 65 8,1; 66 8,1.5; 67 8,2; 68 8,2.5; 69 8,3; 70 8,3.5; 71 8,4; 72 8,4.5; 73 8,5; 74 8,5.5; 75 8,6 | smd 0.3 x 1.5: 26 -6,-8; 27 -5.5,-8; 28 -5,-8; 29 -4.5,-8; 30 -4,-8; 31 -3.5,-8; 32 -3,-8; 33 -2.5,-8; 34 -2,-8; 35 -1.5,-8; 36 -1,-8; 37 -0.5,-8; 38 0,-8; 39 0.5,-8; 40 1,-8; 41 1.5,-8; 42 2,-8; 43 2.5,-8; 44 3,-8; 45 3.5,-8; 46 4,-8; 47 4.5,-8; 48 5,-8; 49 5.5,-8; 50 6,-8; 76 6,8; 77 5.5,8; 78 5,8; 79 4.5,8; 80 4,8; 81 3.5,8; 82 3,8; 83 2.5,8; 84 2,8; 85 1.5,8; 86 1,8; 87 0.5,8; 88 0,8; 89 -0.5,8; 90 -1,8; 91 -1.5,8; 92 -2,8; 93 -2.5,8; 94 -3,8; 95 -3.5,8; 96 -4,8; 97 -4.5,8; 98 -5,8; 99 -5.5,8; 100 -6,8
SOIC16 = smd 1.27 x 0.635: 1 -2.54,3.81; 2 -2.54,2.54; 3 -2.54,1.27; 4 -2.54,0; 5 -2.54,-1.27; 6 -2.54,-2.54; 7 -2.54,-3.81; 8 -2.54,-5.08; 9 2.54,-5.08; 10 2.54,-3.81; 11 2.54,-2.54; 12 2.54,-1.27; 13 2.54,0; 14 2.54,1.27; 15 2.54,2.54; 16 2.54,3.81
W237-4P = drill 1.194 long: 1 -7.62,-0.635; 2 -2.54,-0.635; 3 2.54,-0.635; 4 7.62,-0.635
W237-3E = drill 1.194 long: 1 -5.08,-0.635; 2 0,-0.635; 3 5.08,-0.635
W237-132 = drill 1.194 long: 1 -2.54,-0.635; 2 2.54,-0.635
WE-XTAL_HC49/4H = drill 0.7: 1 -2.44,0; 2 2.44,0

### Placement (x,y rotation side)
C1  27.43,20.95 270 top
C2  30.48,48.77 180 top
C4  30.48,39.12 180 top
C8  34.8,75.56 270 top
C9  37.08,75.69 90 top
C11  28.07,90.17 0 top
C13  45.09,15.24 0 top
C14  60.71,1.78 180 top
C15  61.21,14.99 180 top
C16  38.35,18.16 0 top
C17  38.35,15.62 0 top
C18  31.88,84.71 90 top
C19  21.97,84.84 270 top
C20  16.38,63.5 90 top
C21  16.51,26.16 90 top
C22  9.65,73.91 270 top
C23  9.65,68.58 270 top
C24  9.91,54.86 270 top
C25  9.91,49.53 270 top
C26  9.65,35.81 270 top
C27  9.65,30.73 270 top
C28  9.65,18.03 270 top
C29  9.65,12.7 270 top
C30  41.53,59.31 225 top
C31  36.7,54.48 225 top
C32  41.66,35.43 315 top
C33  55.24,32.38 45 top
C34  62.61,39.62 225 top
C35  58.67,49.53 135 top
C36  62.74,39.88 90 bottom
C37  31.37,67.94 180 top
C38  31.5,58.8 0 top
D1  46.1,11.56 270 top
D2  38.35,13.46 0 top
D4  31.37,27.18 270 top
H1  95.25,4.57 0 top
H2  95.25,95.25 0 top
H3  4.57,4.57 0 top
H4  4.57,95.5 0 top
IC1  23.5,20.95 270 top
J1  49.53,92.71 0 top
J2  52.83,7.37 180 top
JP2  51.05,29.08 180 top
LED1  21.84,42.29 270 top
LED2  46.48,62.23 90 top
LED3  51.69,21.97 90 top
LED4  56.26,21.84 90 top
Q1  80.26,28.07 270 top
Q2  12.19,78.49 180 bottom
Q3  11.94,59.44 180 bottom
Q4  78.99,35.31 270 top
Q5  12.19,40.39 180 bottom
Q6  11.94,22.61 180 bottom
Q7  93.09,75.31 180 top
Q8  67.94,70.48 270 top
Q9  68.2,64.14 270 top
Q10  68.2,77.09 270 top
Q11  68.07,84.96 270 top
Q12  72.52,50.29 90 top
Q13  72.52,45.72 90 top
R1  27.05,25.78 0 top
R2  69.6,50.29 270 top
R3  75.69,50.42 270 top
R4  69.6,45.72 90 top
R5  75.69,45.72 270 top
R6  23.5,28.96 90 top
R7  36.96,63.37 90 top
R8  20.07,25.78 180 top
R9  25.4,15.75 0 top
R10  23.88,42.16 90 top
R11  48.64,62.36 270 top
R12  21.34,15.75 0 top
R13  23.37,13.59 180 top
R14  53.98,21.84 90 top
R15  49.4,21.97 90 top
R16  59.18,21.84 270 top
R17  61.34,21.84 270 top
R18  20.07,57.91 180 top
R19  20.07,60.2 180 top
R20  20.07,67.94 180 top
R25  17.91,18.29 180 top
R26  17.91,20.45 180 top
R27  16.76,31.11 180 top
R32  35.81,44.2 270 top
R33  35.81,34.67 270 top
R35  23.62,52.58 90 top
R36  26.04,52.58 90 top
R37  77.22,27.94 90 top
R38  78.74,30.86 0 top
R39  88.27,28.32 90 top
R40  9.4,78.49 270 bottom
R41  12.19,81.53 0 bottom
R42  15.24,79.5 90 bottom
R43  14.73,60.45 90 bottom
R44  11.68,62.48 180 bottom
R45  9.14,59.44 270 bottom
R46  78.87,38.1 180 top
R47  76.33,35.18 270 top
R48  86.23,28.32 90 top
R49  9.4,40.39 270 bottom
R50  12.19,43.43 0 bottom
R51  14.99,41.4 90 bottom
R52  9.14,22.61 270 bottom
R53  11.68,25.65 0 bottom
R54  14.73,23.62 90 bottom
R55  90.3,75.31 270 top
R56  95.89,75.82 270 top
R57  92.84,78.49 180 top
R58  64.64,70.99 90 top
R59  71.25,71.75 90 top
R60  64.9,64.64 90 top
R61  71.5,65.41 90 top
R62  64.9,77.85 90 top
R63  71.5,78.61 90 top
R64  64.77,85.47 90 top
R65  71.37,84.71 270 top
SV1  39.62,23.75 180 top
SV2  90.42,49.02 270 top
SV3  84.07,65.02 90 top
SV4  87,82.17 270 top
SV5  90.42,35.05 270 top
SV6  6.35,73.66 90 top
SV7  6.35,35.56 90 top
SV8  6.35,17.78 90 top
SV9  6.35,54.61 90 top
SV10  90.42,65.02 90 top
SV11  84.07,35.05 270 top
SV12  39.75,28.96 180 top
SV13  84.07,49.02 270 top
SV14  71.12,33.78 180 top
SV15  71.12,29.97 180 top
SV16  71.12,26.16 180 top
SV17  71.12,22.35 180 top
SV20  90.42,21.08 90 top
SV21  84.07,21.08 270 top
TP1  34.92,67.94 0 top
TP3  77.47,64.26 0 top
TP4  78.74,68.45 0 top
TP5  79.5,72.01 0 top
U1  33.66,42.04 0 top
U2  33.66,32.38 0 top
U3  48.01,75.18 180 top
U5  13.72,63.5 180 top
U6  13.72,26.16 180 top
U7  26.92,84.71 180 top
U8  50.16,42.8 225 top
U9  34.67,61.09 0 top
U$1  51.82,13.72 90 top
X1  76.96,7.75 0 top
X2  23.11,7.62 0 top
X4  38.35,7.62 0 top
Y2  61.47,8.38 270 top
Y3  41.78,54.23 45 top

### Tracks (layer width: path | path; a pad name or v marks a point on that pad's centre or on a via)
+3V3  (via drill 0.35)
  Top 0.305: U$1.4 v51.82,12.83
  Top 0.406: R64.2 66.59,86.42 Q11.1 67.12,85.91 68.13,84.91 68.13,77.6 | 68.13,77.6 68.13,71.25 | 68.13,71.25 68.13,70.96 68.01,70.85 68.01,70.12 68.07,70.06 68.07,65.93 Q9.1 | Q8.1 67.94,71.44 68.13,71.25 | Q10.1 67.69,78.04 68.13,77.6
  Top 0.508: Q12.1 73.62,49.47 | 73.62,49.47 R3.2 | 72.52,48.39 72.52,45.74 Q13.1 R5.2 | 72.52,48.39 73.6,49.47 73.62,49.47 | SV13.1 73.15,52.83 72.52,52.2 72.52,48.39
  Top 0.61: Q10.1 66.46,78.8 R62.2 v64.9,80.52 | Q8.1 66.46,71.94 R58.2 64.9,72.2 v64.9,73.28 | Q9.1 66.72,65.59 R60.2 v64.9,67.06 | U3.13 51.55,74.18 v51.56,74.17
  Top 0.813: 36.58,74.18 35.23,74.18 C8.2
  Top 1.016: U7.4 U7.2 27.12,88.28 C11.1 | U7.4 28.8,83.21 C18.1 | U3.13 36.58,74.18 | C9.1 35.22,74.19 C8.2 | U7.4 26.92,76.2 28.94,74.18 35.23,74.18
  Bottom 0.305: v51.82,12.83 55.75,16.76 76.96,16.76 79.63,19.43 79.63,26.04 81.28,27.69 85.34,27.69 87.12,29.46 87.12,51.69 85.98,52.83 SV13.1
  Bottom 0.61: v64.9,80.52 v64.9,73.28 | v64.9,73.28 v64.9,67.06 64.9,56.9 68.96,52.83 SV13.1 | v51.56,74.17 64.01,74.17 v64.9,73.28
+5V  (via drill 0.35)
  Top 0.203: R36.2 27.77,53.43 v27.81,53.47
  Top 0.305: U5.8 13.72,62.36 14.1,62.74 16.2,62.74 C20.1 | U6.8 13.72,24.89 14.22,25.4 16.32,25.4 C21.1 | U8.61 42.06,36.1 C32.1 v40.13,36.96 | U8.80 54.57,32.73 C33.1 | C34.1 61.15,40.3 U8.100 59.03,42.42 v58.29,42.42 | U8.10 58.35,48.86 C35.1 | U5.1 14.72,66.28 15.11,66.67 20.89,66.67 21.02,66.55 | C35.1 64.6,48.86 64.87,48.59 68.85,48.59 R2.2 | R27.1 22.29,31.11 R6.2 | U8.31 45.69,52.23 v45.24,52.23 | R7.2 38.17,65.53 v38.35,65.53 | C35.1 60.2,48.01 v60.2,46.61 | R10.2 v23.88,44.58 | v40.13,36.96 | R32.2 v35.81,42.04
  Top 0.406: R1.2 27.94,25.84 27.94,28.32 28.7,29.08 D4.C 32.76,29.08 35.31,31.62 35.31,33.21 R33.2 38.6,33.72 C32.1
  Top 0.508: R1.2 31.75,22.03 31.75,17.21 | R4.2 R2.2 | R16.2 R17.2 61.34,19.75 71.66,9.44 71.66,5.3 73.28,3.68 77.98,3.68 79.5,5.21 X1.3 | R36.2 R35.2 23.62,55.31 R18.1 | C33.1 52.32,29.46 JP2.1 | C17.1 36.85,13.86 D2.C
  Top 0.61: 27.16,20 C1.2 27.43,18.67 27.01,18.24 IC1.8 | R18.1 R19.1 | C20.1 20,62.55 21.02,61.53 R18.1 | R20.1 21.02,66.55 R18.1 | R65.2 v71.37,81.15 71.37,79.69 R63.2 | 17.91,25.21 17.91,30.92 R27.1 | SV14.1 73.66,22.1 73.91,21.84 | v71.37,74.3 71.37,72.83 R59.2 | v71.37,67.94 71.37,66.48 R61.2 | D1.C 46.03,13.52 C13.2 | U$1.16 46.99,15.24 C13.2 | C16.1 37.4,19.12 38.61,20.32 43.94,20.32 46.03,18.23 C13.2
  Top 0.813: C21.1 7.43,25.21 SV8.6 3.94,24.13 2.79,25.27 2.79,43.05 | C20.1 7.94,62.55 SV9.6 3.94,60.96 2.79,62.1 | SV6.6 3.68,80.01 2.79,79.12 2.79,62.1 | 2.79,62.1 2.79,43.05 | SV7.6 3.94,41.91 2.79,43.05 | R63.2 85.66,79.56 SV4.5
  Top 1.016: D2.C 36.45,17.21 | 36.45,17.21 C16.1 | 36.45,17.21 31.75,17.21 30.23,17.21 C1.2 26.99,20.45 R26.1 | U7.3 24.62,86.85 23.5,85.72 22.03,85.72 | 22.03,85.72 C19.1 | SV6.6 12.06,85.72 22.03,85.72 | SV3.1 SV10.1 | SV11.1 SV5.1 | SV21.1 SV20.4 | R26.1 R25.1 20.39,16.76 R12.1 | C21.1 17.91,25.21 18.55,25.21 R8.2 19.12,20.71 R26.1
  Bottom 0.508: 79.5,16.51 X1.3
  Bottom 0.61: v71.37,81.15 v71.37,74.3 v71.37,67.94
  Bottom 0.813: SV10.1 SV2.1
  pour Bottom (isolate 0.406, no thermals): -4.57,80.9 103.38,80.9 104.27,80.01 104.27,-1.27 101.22,-4.32 -3.68,-4.32 -4.32,-3.68 -4.32,80.64
A1_N
  Top 0.305: U5.5 12.72,69.07 11.94,69.85 SV6.2 9.33,69.85 C23.1
A1_P
  Top 0.305: U5.4 13.22,73.65 11.94,74.93 SV6.4 9.59,74.93 C22.1
A2_N
  Top 0.305: U5.7 13.22,51.57 12.19,50.55 9.84,50.55 | SV9.2 6.6,50.55 9.84,50.55 | C25.1 9.84,50.55
A2_P
  Top 0.305: U5.6 12.72,56.66 11.94,55.88 SV9.4 9.84,55.88 C24.1
ADC1
  Top 0.305: U8.96 66.74,31.88 70.1,31.88 71.12,32.89 SV14.2
ADC2
  Top 0.305: U8.95 66.55,31.37 66.55,28.83 67.31,28.07 70.1,28.07 71.12,29.08 SV15.2
ADC3
  Top 0.305: U8.94 65.91,31.29 65.91,25.53 67.18,24.26 70.1,24.26 71.12,25.27 SV16.2
ADC4
  Top 0.305: U8.93 65.46,31.04 65.46,21.79 66.8,20.45 70.1,20.45 71.12,21.46 SV17.2
ADC7
  Top 0.305: U8.90 65,29.38 65,21.6 74.42,12.18 X1.2
ANT
  Top 1.27: U3.9 46.99,82.18 arc90 49.53,84.72 J1.1
AREF  (via drill 0.35)
  Top 0.305: U8.98 60.43,39.61 v60.43,39.35
  Bottom 0.305: v60.43,39.35 62.32,39.35 C36.1
B1
  Top 0.305: U1.3 33.66,41.66 36.24,39.07 39.37,39.07 U8.53
  Top 0.61: C2.1 31.43,47.31 32.26,46.48 33.6,46.48 U1.4 33.66,45.21 | 33.66,45.21 U1.3 | R32.1 33.72,45.15 33.66,45.21
B1_N
  Top 0.305: U6.5 12.72,30.97 11.94,31.75 SV7.2 9.59,31.75 C27.1
B1_P
  Top 0.305: U6.4 13.22,35.55 11.94,36.83 SV7.4 9.59,36.83 C26.1
B2
  Top 0.305: U8.54 36.62,35.62 R33.1
  Top 0.61: C4.1 31.43,37.4 32,36.83 33.6,36.83 U2.4 33.66,35.56 | 33.66,35.56 U2.3 | R33.1 35.75,35.56 33.66,35.56
B2_N
  Top 0.305: U6.7 13.22,15.25 11.94,13.97 SV8.2 9.33,13.97 C29.1
B2_P
  Top 0.305: U6.6 12.72,20.08 11.68,19.05 SV8.4 9.59,19.05 C28.1
CLK
  Top 0.508: U3.4 58.74,74.19 60.69,76.14 Q10.2
  Top 0.61: Q10.2 65.66,76.14 R62.1 64.82,76.98
CS
  Top 0.406: Q11.2 65.28,84.01 R64.1
  Top 0.508: R64.1 60.58,80.33 60.58,78.25 58.51,76.18 U3.5
CS_A  (via drill 0.35)
  Top 0.305: U8.19 59.64,56.52 v68.07,56.52 | v69.47,86.11 69.47,84.96
  Top 0.406: Q11.3 69.47,84.96 70.68,84.96 R65.1
  Bottom 0.305: v68.07,56.52 68.07,84.71 v69.47,86.11
CS_B  (via drill 0.35)
  Top 0.305: U8.18 59.58,55.75 v75.82,55.75 | v80.26,70.99 81.03,70.99 81.99,70.03 85.53,70.03 86.73,68.83 SV10.5
  Bottom 0.305: v75.82,55.75 75.82,66.55 v80.26,70.99
CS_C
  Top 0.305: U8.17 59.61,55.07 90.52,55.07 93.17,57.72 93.17,65.95 91.63,67.49 85.42,67.49 SV3.5
DE  (via drill 0.35)
  Top 0.305: U8.15 54.21,48.26 v52.58,48.26 | v25.02,29.21 23.82,28.01 R6.1
  Top 0.508: IC1.3 23.37,23.67 | 23.37,23.67 IC1.2 | 23.37,23.67 23.5,23.79 R6.1
  Bottom 0.305: v52.58,48.26 52.58,47.26 52.38,47.05 52.38,45.67 38.53,31.83 34.99,31.83 33.26,30.1 26.45,30.1 25.57,29.21 v25.02,29.21
DI
  Top 0.508: 64.5,70.04 62.35,72.18 U3.3
  Top 0.61: Q8.2 65.15,69.53 R58.1 64.5,70.04
DIO0
  Top 0.305: U8.25 51.58,68.91 48.3,72.18 U3.14
DO
  Top 0.508: U3.2 57.12,70.18 63.61,63.69 R60.1
  Top 0.61: Q9.2 65.41,63.19 R60.1 64.75,63.69
DTR  (via drill 0.35)
  Top 0.305: C38.1 31.11,58.23 v31.11,57.4 | SV1.4 37.08,22.99 35.94,21.84 32.84,21.84 30.39,24.3 30.36,24.32 30.23,24.46 30.23,26.16 30.86,26.8 31.37,26.8 v37.21,32.64
  Top 0.406: U$1.13 51.82,16.64 v53.09,17.91
  Bottom 0.305: v31.11,57.4 39.29,49.23 39.29,47.6 37.21,45.52 v37.21,32.64
  Bottom 0.406: v53.09,17.91 50.95,17.91 50.47,17.43 40.74,17.43 37.08,21.08 SV1.4
EN_AM  (via drill 0.35)
  Top 0.305: U8.92 55.91,39.88 v55.88,39.88 | R47.2 76.33,34.31 74.34,36.29 74.34,36.6 73.59,37.36 v73.28,37.36
  Bottom 0.305: v55.88,39.88 60.61,35.15 61.29,35.15 61.52,34.92 66.55,34.92 67.82,36.2 72.12,36.2 v73.28,37.36
EN_BME  (via drill 0.35)
  Top 0.305: R37.1 74.98,29.12 74.98,34.86 73.53,36.31 v73.53,36.45 | v60.88,34.46 60.62,34.46 U8.91
  Bottom 0.305: v73.53,36.45 72.82,35.74 68.01,35.74 66.74,34.46 v60.88,34.46
EN_OPC
  Top 0.305: U8.16 59.86,54.61 90.7,54.61 93.62,57.53 93.62,69.37 96.9,72.64 96.9,75.86 R56.1
EN_SENS1  (via drill 0.35)
  Top 0.305: v15.24,76.58 26.72,65.1 26.72,60.54 34.94,52.33 37.81,52.33 U8.42
  Bottom 0.305: R42.1 v15.24,76.58
EN_SENS2  (via drill 0.35)
  Top 0.305: v14.73,56.52 16.84,54.4 16.84,52.55 19.57,49.82 38.19,49.82 U8.45
  Bottom 0.305: R43.1 v14.73,56.52
EN_SENS3  (via drill 0.35)
  Top 0.305: v15.11,38.23 15.11,43.18 v20.57,48.64 | U8.46 39.17,48.13 v38.61,48.13
  Bottom 0.305: R51.1 14.99,38.35 v15.11,38.23 | v20.57,48.64 38.1,48.64 v38.61,48.13
EN_SENS4  (via drill 0.35)
  Top 0.305: v16.38,37.34 16.38,43.29 v20.83,47.73 | U8.47 39.24,47.36 v38.09,47.36
  Bottom 0.305: R54.1 15.71,22.57 16.38,23.24 v16.38,37.34 | v20.83,47.73 21.28,48.18 37.27,48.18 v38.09,47.36
GND  (via drill 0.35)
  Top 0.305: 14.1,64.39 13.72,64.77 U5.3 | 14.1,64.39 16.32,64.39 C20.2 | U6.3 13.72,27.18 14.1,26.8 | 14.1,26.8 14.73,26.8 | 14.73,26.8 16.2,26.8 C21.2 | U6.1 14.73,28.2 14.73,26.8 | U8.62 42.33,35.67 C32.2 | U8.81 54.96,33.06 C33.2 | C34.2 61.79,38.95 U8.99 59.01,41.73 57.12,41.73 55.2,43.66 55.2,44.23 55.63,44.65 55.63,46.85 U8.11 58,49.22 C35.2 | 14.1,26.8 v13.21,26.8 10.54,26.8 | 10.54,26.8 9.65,27.69 C27.2 | 14.1,64.39 10.16,64.39 | 10.16,64.39 9.65,64.9 C23.2 | C22.2 9.65,72.64 8.13,71.12 4.83,71.12 4.06,70.36 4.06,65.53 5.21,64.39 10.16,64.39 | C24.2 8.06,52.07 4.7,52.07 4.06,51.44 4.06,47.12 4.83,46.35 9.4,46.35 9.91,46.86 C25.2 | C26.2 7.81,33.02 4.57,33.02 4.06,32.51 4.06,28.07 5.33,26.8 10.54,26.8 | C28.2 7.81,15.24 4.83,15.24 4.06,14.48 4.06,10.29 4.57,9.78 8.38,9.78 9.65,11.05 C29.2 | R39.1 R48.1 85.88,27.12 Q1.2 | U3.1 54.48,66.96 v54.48,59.56 | v42.93,58.8 42.13,59.6 C30.1 | LED2.C 46.48,59.69 v46.35,59.56 | U8.32 47.88,49.33 v47.88,49.28 | C15.2 60.36,14.26 v58.93,12.83 | v58.29,7.11 57.49,7.11 J2.S1 | v75.18,36.58 75.52,36.91 75.52,37.11 76.51,38.1 R46.2 | v77.85,32.77 77.85,34.19 Q4.2
  Top 0.406: IC1.5 20.87,18.24 v20.32,18.8 | v26.42,14.1 26.35,14.16 R9.2 | C1.1 27.3,22.03 v27.3,23.62
  Top 0.61: C8.1 35.48,77.19 36.96,77.19 | 36.96,77.19 C9.2 | U3.10 38.27,80.18 36.96,78.87 36.96,77.19 | v80.9,45.21 75.44,39.75 v70.87,39.75
  Top 0.813: C8.1 34.54,76.77 34.54,84.45 32.79,86.21 C18.2 31.1,86.21 U7.1
  Top 1.016: C11.2 29.02,88.29 U7.1 | SV13.4 SV2.4 | SV21.4 SV20.1
  Bottom 0.203: R41.1 15.4,83.69 17.14,83.69 v17.27,83.82 | R40.1 9.4,83.69
  Bottom 0.305: Q6.2 12.89,23.56 11.94,22.61 9.99,22.61 R52.1 9.14,26.16 | Q5.2 13.14,41.34 12.19,40.39 10.25,40.39 R49.1 9.4,43.94 10.03,44.58 12.9,44.58 13.24,44.23 | Q3.2 12.89,60.39 11.94,59.44 9.99,59.44 R45.1 9.14,62.99 9.91,63.75 12.52,63.75 12.74,63.54 | R40.1 10.25,78.49 12.19,78.49 13.14,79.44 Q2.2 | R50.1 13.24,44.23 | 13.24,44.23 v13.84,44.83 | R53.1 12.74,26.33 | 12.74,26.33 v13.21,26.8 | 9.14,26.16 9.65,26.67 12.39,26.67 12.74,26.33 | 9.14,26.16 7.35,26.16 v4.3,23.11 | R44.2 12.74,63.54 | 12.74,63.54 v13.34,64.14 | SV1.5 34.54,27.56 SV12.4 | v54.48,59.56 v46.35,59.56 | v46.35,59.56 43.69,59.56 v42.93,58.8 | v47.88,49.28 46.35,50.8 v46.35,59.56 | v58.93,12.83 58.93,7.75 v58.29,7.11 | v75.18,36.58 77.85,33.91 v77.85,32.77
  Bottom 0.406: 26.42,19.3 26.42,22.73 v27.3,23.62 | v20.32,18.8 25.91,18.8 26.42,19.3 | v26.42,14.1 26.42,19.3
  Bottom 0.61: SV13.4 v80.9,45.21 | C36.2 63.19,40.83 63.76,40.26 70.36,40.26 v70.87,39.75
  Bottom 0.813: SV14.3 SV15.3 SV16.3 SV17.3
  other vias: 47.88,87.12 51.18,87.12 51.18,86.11 47.88,86.11 47.88,85.09 51.18,85.09 44.07,86.23 38.86,85.98 2.67,85.34 6.6,85.09 3.05,88.77 21.08,88.9
  pour Top (isolate 0.406, no thermals): 0,101.35 101.47,101.35 101.6,101.22 101.6,-1.27 -1.78,-1.27 -1.91,-1.4 -1.91,99.44
  pour Bottom (isolate 0.406, no thermals): -6.1,105.03 -6.1,82.8 -5.97,82.68 102.11,82.68 103.25,83.82 103.25,102.23 101.47,104.01 -5.08,104.01
L1
  Top 0.305: R11.2 48.75,61.3 U8.26
MISO
  Top 0.305: U8.22 61.45,60.45 66.7,60.45 69.17,62.92 Q9.3
  Top 0.406: TP3.TP 76.39,63.18 76.39,63.06
  Top 0.508: R61.1 74.99,64.45 76.39,63.06 78.23,61.21 SV3.2
  Top 0.61: Q9.3 71.18,64.14 R61.1 71.82,64.14
  Bottom 0.406: SV4.6 88.27,61.47 88.65,61.09 90.3,61.09 SV10.2
  Bottom 0.61: SV10.2 SV3.2
MOSI
  Top 0.305: U8.21 61.65,59.94 85.33,59.94 86.49,61.1 86.49,63.75
  Top 0.406: TP4.TP 77.66,67.37 77.53,67.37
  Top 0.508: R59.1 74.1,70.81 77.53,67.37 81.15,63.75 SV3.3
  Top 0.61: R59.1 70.93,70.48 Q8.3 | SV10.3 86.49,63.75 SV3.3
  Bottom 0.406: SV4.3 81.79,78.23 81.79,65.02 83.06,63.75 SV3.3
N$1
  Top 0.61: SV12.1 49.66,28.96 JP2.2
N$2
  Top 0.305: R39.2 87.42,28.32 82.17,28.32 81.92,28.07 Q1.3
  Top 0.61: R39.2 89.88,29.17 90.42,29.72 SV5.4
N$3
  Top 0.305: R37.2 79.26,28.99 Q1.1 79.29,30.36 R38.2
N$8
  Bottom 0.305: SV8.5 4.45,21.59 4.06,21.21 4.06,16.38 | 4.06,16.38 4.06,11.81 4.45,11.43 SV8.1 | SV8.3 4.19,16.51 4.06,16.38
  Bottom 0.406: Q6.3 11.81,21.76 R52.2 6.52,21.76 SV8.5
N$9
  Bottom 0.305: SV6.5 4.57,77.47 3.94,76.83 3.94,72.39 | 3.94,72.39 3.94,67.94 4.57,67.31 SV6.1 | SV6.3 3.94,72.39
  Bottom 0.406: Q2.3 12.07,77.64 R40.2 6.52,77.64 SV6.5
N$10
  Top 0.61: R10.1 21.87,41.21 LED1.A
N$11
  Top 0.406: R11.1 48.61,63.28 LED2.A
N$13
  Top 0.305: U$1.2 49.28,14.74 48.65,15.37 48.65,20.27 R15.1
N$14
  Top 0.305: U$1.3 50.55,14.74 51.17,15.37 51.17,17.51 53.98,20.32 R14.1
N$15
  Top 0.305: U$1.8 57.25,10.82 Y2.1
  Top 0.406: C15.1 62.06,11.42 Y2.1
N$16
  Top 0.305: U$1.7 55.63,10.3 56.53,9.4 58.27,9.4 61.47,6.2 Y2.2
  Top 0.406: C14.1 61.56,5.85 Y2.2
N$17
  Top 0.305: LED3.A 51.69,23.19 54.58,26.08 58.05,26.08 R17.1
N$18
  Top 0.61: LED4.A 59.08,22.89 R16.1
N$19
  Bottom 0.305: SV7.5 4.45,39.37 4.06,38.99 4.06,34.16 | 4.06,34.16 4.06,29.46 4.32,29.21 SV7.1 | SV7.3 4.19,34.29 4.06,34.16
  Bottom 0.406: Q5.3 12.07,39.54 R49.2 6.52,39.54 SV7.5
N$20
  Bottom 0.406: R41.2 11.24,81.43 Q2.1 12.34,80.56 R42.2
N$21
  Top 1.016: X4.2 40.89,12.82 D2.A
N$22
  Top 0.305: U5.2 14.22,67.05 15.11,67.94 R20.2
N$23
  Top 0.305: 43.43,55.88 Y3.2 43.63,55.83 43.63,52.86 U8.33
  Top 0.508: Y3.2 40.93,58.53 C30.2
N$24
  Top 0.406: SV1.1 44.7,24.51 43.18,26.04 32.13,26.04 D4.A
N$25
  Top 0.305: U6.2 14.22,29.52 R27.2
N$27
  Top 0.305: Y3.1 43.29,52.5 U8.34
  Top 0.508: Y3.1 37.48,55.08 C31.1
N$28
  Top 0.305: SV11.4 82.93,31.24 79.97,34.2 Q4.3
  Top 0.61: R48.2 84.75,29.17 84.07,29.84 SV11.4
N$29
  Bottom 0.305: SV9.5 4.45,58.42 4.06,58.04 4.06,53.34 | 4.06,53.34 4.06,48.64 4.45,48.26 SV9.1 | SV9.3 4.06,53.34
  Bottom 0.406: Q3.3 11.81,58.59 R45.2 6.52,58.59 SV9.5
N$30
  Top 0.61: 22.86,14.03 22.86,11.81 X2.1 | R12.2 22.86,16.32 IC1.6 22.86,15.49 22.86,14.03 | R13.2 22.86,14.03
N$31
  Top 0.61: X2.3 28.19,7.75 24.13,11.81 IC1.7 24.13,16.07 R9.1 24.32,15.62 R13.1
N$32
  Bottom 0.406: R44.1 10.99,62.13 Q3.1 12.08,61.51 R43.2
N$33
  Top 0.305: R46.1 79.92,36.87 79.31,36.26 Q4.1 78,36.23 R47.1
N$34
  Bottom 0.406: R53.2 10.99,25.3 Q6.1 12.08,24.67 R54.2
N$35
  Bottom 0.406: R50.2 11.24,43.33 Q5.1 12.34,42.45 R51.2
N$36
  Top 0.406: Q7.3 92.97,74.46 R55.2 90.3,71.5 SV10.6
N$38
  Top 0.406: R57.1 94.04,78.33 Q7.1 95.56,74.77 R56.2
NRST  (via drill 0.35)
  Top 0.305: U8.30 44.54,54.08 44.54,58.83 42.29,61.08 38.3,61.08 R7.1 | v81.79,51.56 81.99,51.77 85.28,51.77 87.67,54.16 90.89,54.16 94.08,57.34 94.08,69.18 97.36,72.45 97.36,77.21 95.27,79.29 93.68,79.29 SV4.2
  Top 0.406: C37.1 TP1.TP
  Top 0.61: 34.67,62.36 U9.4 34.62,65.53 33.53,65.53 32.32,66.74 C37.1 | 34.67,62.36 U9.3 33.53,61.09 32.45,60.01 C38.2 | R7.1 34.74,62.42 34.67,62.36
  Bottom 0.305: U9.4 37.44,65.58 38.07,66.22 61.95,66.22 64.29,63.88 64.29,56.64 69.37,51.56 v81.79,51.56
RST
  Top 0.305: U8.24 52.83,53.24 52.83,75.94 55.08,78.18 U3.6
RX0  (via drill 0.35)
  Top 0.305: v55.88,43.94 56.44,43.94 56.99,43.39 58.53,43.39 U8.2 | v52.96,25.53 52.01,25.53 R15.2
  Top 0.406: R15.2 50.3,22.03 50.36,21.97 50.93,21.97 51.69,21.21 LED3.C 51.69,19.68 v50.16,18.16
  Bottom 0.305: v55.88,43.94 55.88,43.32 54.41,41.84 54.41,26.98 v52.96,25.53
  Bottom 0.406: SV1.3 39.57,23.7 39.57,20.85 42.26,18.16 v50.16,18.16
RXB
  Top 0.305: U8.63 43.62,36.26 43.62,34.71 42.38,33.47 40.83,33.47 38.48,31.11 SV12.3
RXR  (via drill 0.35)
  Top 0.305: U8.12 54.81,46.74 v54.74,46.74 | v26.92,28.96 25.4,27.43 25.4,26.42 25.4,25.78
  Top 0.508: IC1.1 25.4,25.78 25.4,26.29 | 25.4,26.42 26.04,25.78 R1.1
  Bottom 0.305: v54.74,46.74 38.91,30.91 35.37,30.91 33.42,28.96 v26.92,28.96
SCK
  Top 0.305: U8.20 59.69,57.28 92.08,57.28 92.71,57.91 92.71,65.53 91.95,66.29 SV10.4
  Top 0.406: TP5.TP 78.33,70.83
  Top 0.508: R63.1 78.33,70.83 82.87,66.29 SV3.4
  Top 0.61: R63.1 70.93,77.09 Q10.3 | SV3.4 SV10.4
  Bottom 0.406: SV4.4 87.76,82.17 87,81.41 87,67.06 86.23,66.29 SV3.4
SCL  (via drill 0.35)
  Top 0.305: U5.10 14.72,60.72 15.24,60.2 v17.65,60.2 R19.2 | U6.10 16.96,21.87 R26.2 | v17.65,52.96 22.48,52.96 22.82,52.62 25.14,52.62 R36.1 26.67,51.09 38.34,51.09 U8.43 43.83,45.59 44.58,45.59 v45.97,44.2 | R4.1 68.64,44.77 v65.53,47.88
  Top 0.406: 16.96,21.87 17.57,22.48 v17.65,22.48
  Top 0.508: R4.1 70.59,44.77 Q13.3
  Top 1.016: SV11.3 SV5.3 | SV21.3 SV20.2
  Bottom 0.305: v45.97,44.2 50.72,48.94 53.12,48.94 53.8,48.26 65.15,48.26 v65.53,47.88 79.63,33.78 SV11.3
  Bottom 0.406: v17.65,22.48 v17.65,52.96 v17.65,60.2
  Bottom 0.61: SV5.3 92.46,33.78 93.09,33.15 | 93.09,33.15 93.09,20.32 92.58,19.81 SV20.2 | 93.09,33.15 93.09,47.37 92.71,47.75 SV2.3
SCL3
  Top 0.508: SV13.3 80.52,47.75 79.44,46.67 R5.1 Q13.2
SDA  (via drill 0.35)
  Top 0.305: U5.9 14.22,58.55 14.86,57.91 R18.2 | U6.9 14.34,23.98 14.34,19.18 | 14.34,19.18 14.34,18.93 14.99,18.29 R25.2 | 14.34,19.18 v14.99,19.18 | U8.44 42.27,46.46 | 42.27,46.46 38.17,50.55 24.8,50.55 R35.1 | v44.07,44.7 42.32,46.46 42.27,46.46 | v65.53,49.28 67.5,51.24 69.85,51.24
  Top 0.406: v19.18,56.13 19.12,56.2 R18.2 | R35.1 19.22,51.73 v19.18,51.69
  Top 0.508: R2.1 69.85,51.24 70.59,51.24 Q12.3
  Top 0.61: SV5.2 92.33,36.32 93.09,35.56 | 93.09,35.56 93.09,22.99 92.46,22.35 SV20.3 | 93.09,35.56 93.09,50.04 92.84,50.29 SV2.2
  Top 1.016: SV11.2 SV5.2 | SV21.2 SV20.3
  Bottom 0.305: v44.07,44.7 44.7,45.34 46.47,45.34 50.53,49.4 53.3,49.4 53.94,48.77 65.02,48.77 v65.53,49.28 78.49,36.32 SV11.2
  Bottom 0.406: v14.99,19.18 17.65,19.18 19.18,20.7 v19.18,51.69 v19.18,56.13
SDA3
  Top 0.508: SV13.2 80.39,50.29 79.31,51.37 75.95,51.37 R3.1 73.62,51.37 Q12.2
SPEED
  Top 0.305: X1.4 72.31,19.38 72.31,35.11 62.47,44.96 60.81,44.96 U8.1
TX0  (via drill 0.35)
  Top 0.305: U8.3 58.51,44.07 v57.28,44.07 | v54.86,25.4 53.98,24.51 R14.2
  Top 0.406: R14.2 54.87,21.9 54.93,21.84 55.24,21.84 56.26,20.83 LED4.C 56.26,20.19 v55.12,19.05
  Bottom 0.305: v57.28,44.07 54.86,41.66 v54.86,25.4
  Bottom 0.406: SV1.2 42.16,21.08 44.2,19.05 v55.12,19.05
TXB
  Top 0.305: U8.64 44.08,36.01 44.08,34.52 42.57,33.01 41.52,33.01 41.02,32.51 SV12.2
TXR  (via drill 0.35)
  Top 0.305: U8.13 54.86,47.5 v53.47,47.5 | v21.72,27.56 21.59,27.43 21.59,26.16
  Top 0.508: 21.59,26.29 21.59,26.16 IC1.4 21.59,25.21 R8.1
  Bottom 0.305: v53.47,47.5 52.83,46.86 52.83,45.48 38.72,31.37 35.18,31.37 33.45,29.64 26.64,29.64 24.56,27.56 v21.72,27.56
UD+
  Top 0.508: J2.3 52.83,9.91 53.09,10.16 U$1.5
UD-  (via drill 0.35)
  Top 0.508: U$1.6 54.36,10.29 v53.85,9.78 | v52.05,9.78 52.05,7.58 J2.2
  Bottom 0.508: v53.85,9.78 v52.05,9.78
VBUS
  Top 0.508: J2.1 51.23,9.22 50.8,9.66 D1.A
(copper drawn outside any net)
  shapes: Top area x2

### Text on the board
tPlace: RosyProjectMega
tNames: Itis Max Planck | Frequency: 868MHz / 915MHz | CNR-ISP | Vin: +5V | RFM95W | ISP | +5V | GND | OP0 | GND | GND | OP1 | CS | GND | SCK | MOSI | Exp. 3 | opc-n3 | MISO | +5V | Reset | GND | +5V | OP0 | GND | +5V | OP1 | SDA | GND | B1 | rtc | SCL | Exp. 2 | GND | +5V | GND | Power | B2 | +5V | OP0 | S | SDA | GND | SCL | OP1 | GND | r | t | +5V | bme280 | am2315 | GND | GND | HC-06 | +5V | +5V | RX | TX | SDA | GND | GND | +5V | GND | +5V | SCL | OP0 | Exp. 1 | GND | GND | lsm9ds0 | OP1 | Wind | GND | Ferry06 | Vin | RS485 | A | GND | B | GND | +5V | GND | D | +5V | S | v0.3